# Altium project 0020-03_FFT2G.PrjPcb (part 3 of 5)

## Sheet [10] FPGA_ADC_S.SchDoc: FPGA ADC South
size 393 x 281 mm; SheetNumber: 10; SheetTotal: 21; PageSetup: Record=PageOptions|CenterHorizontal=True|CenterVertical=True|PrintScale=0.94|XCorrection=0.00|YCorrection=0.00|PrintKind=0|BorderSize=5000000|LeftOffset=0|BottomOffset=0|Orientation=2|PaperLength=1000|PaperWidth=1000|Scale=100|PaperSource=15|PrintQuality=600|MediaType=1|DitherType=10|PrintScaleMode=1|PaperKind=A4; Adr1: August Barks gata 6B; Adr2: SE-421 32 Västra Frölunda; Adr3: Sweden; Webpage: www.omnisys.se
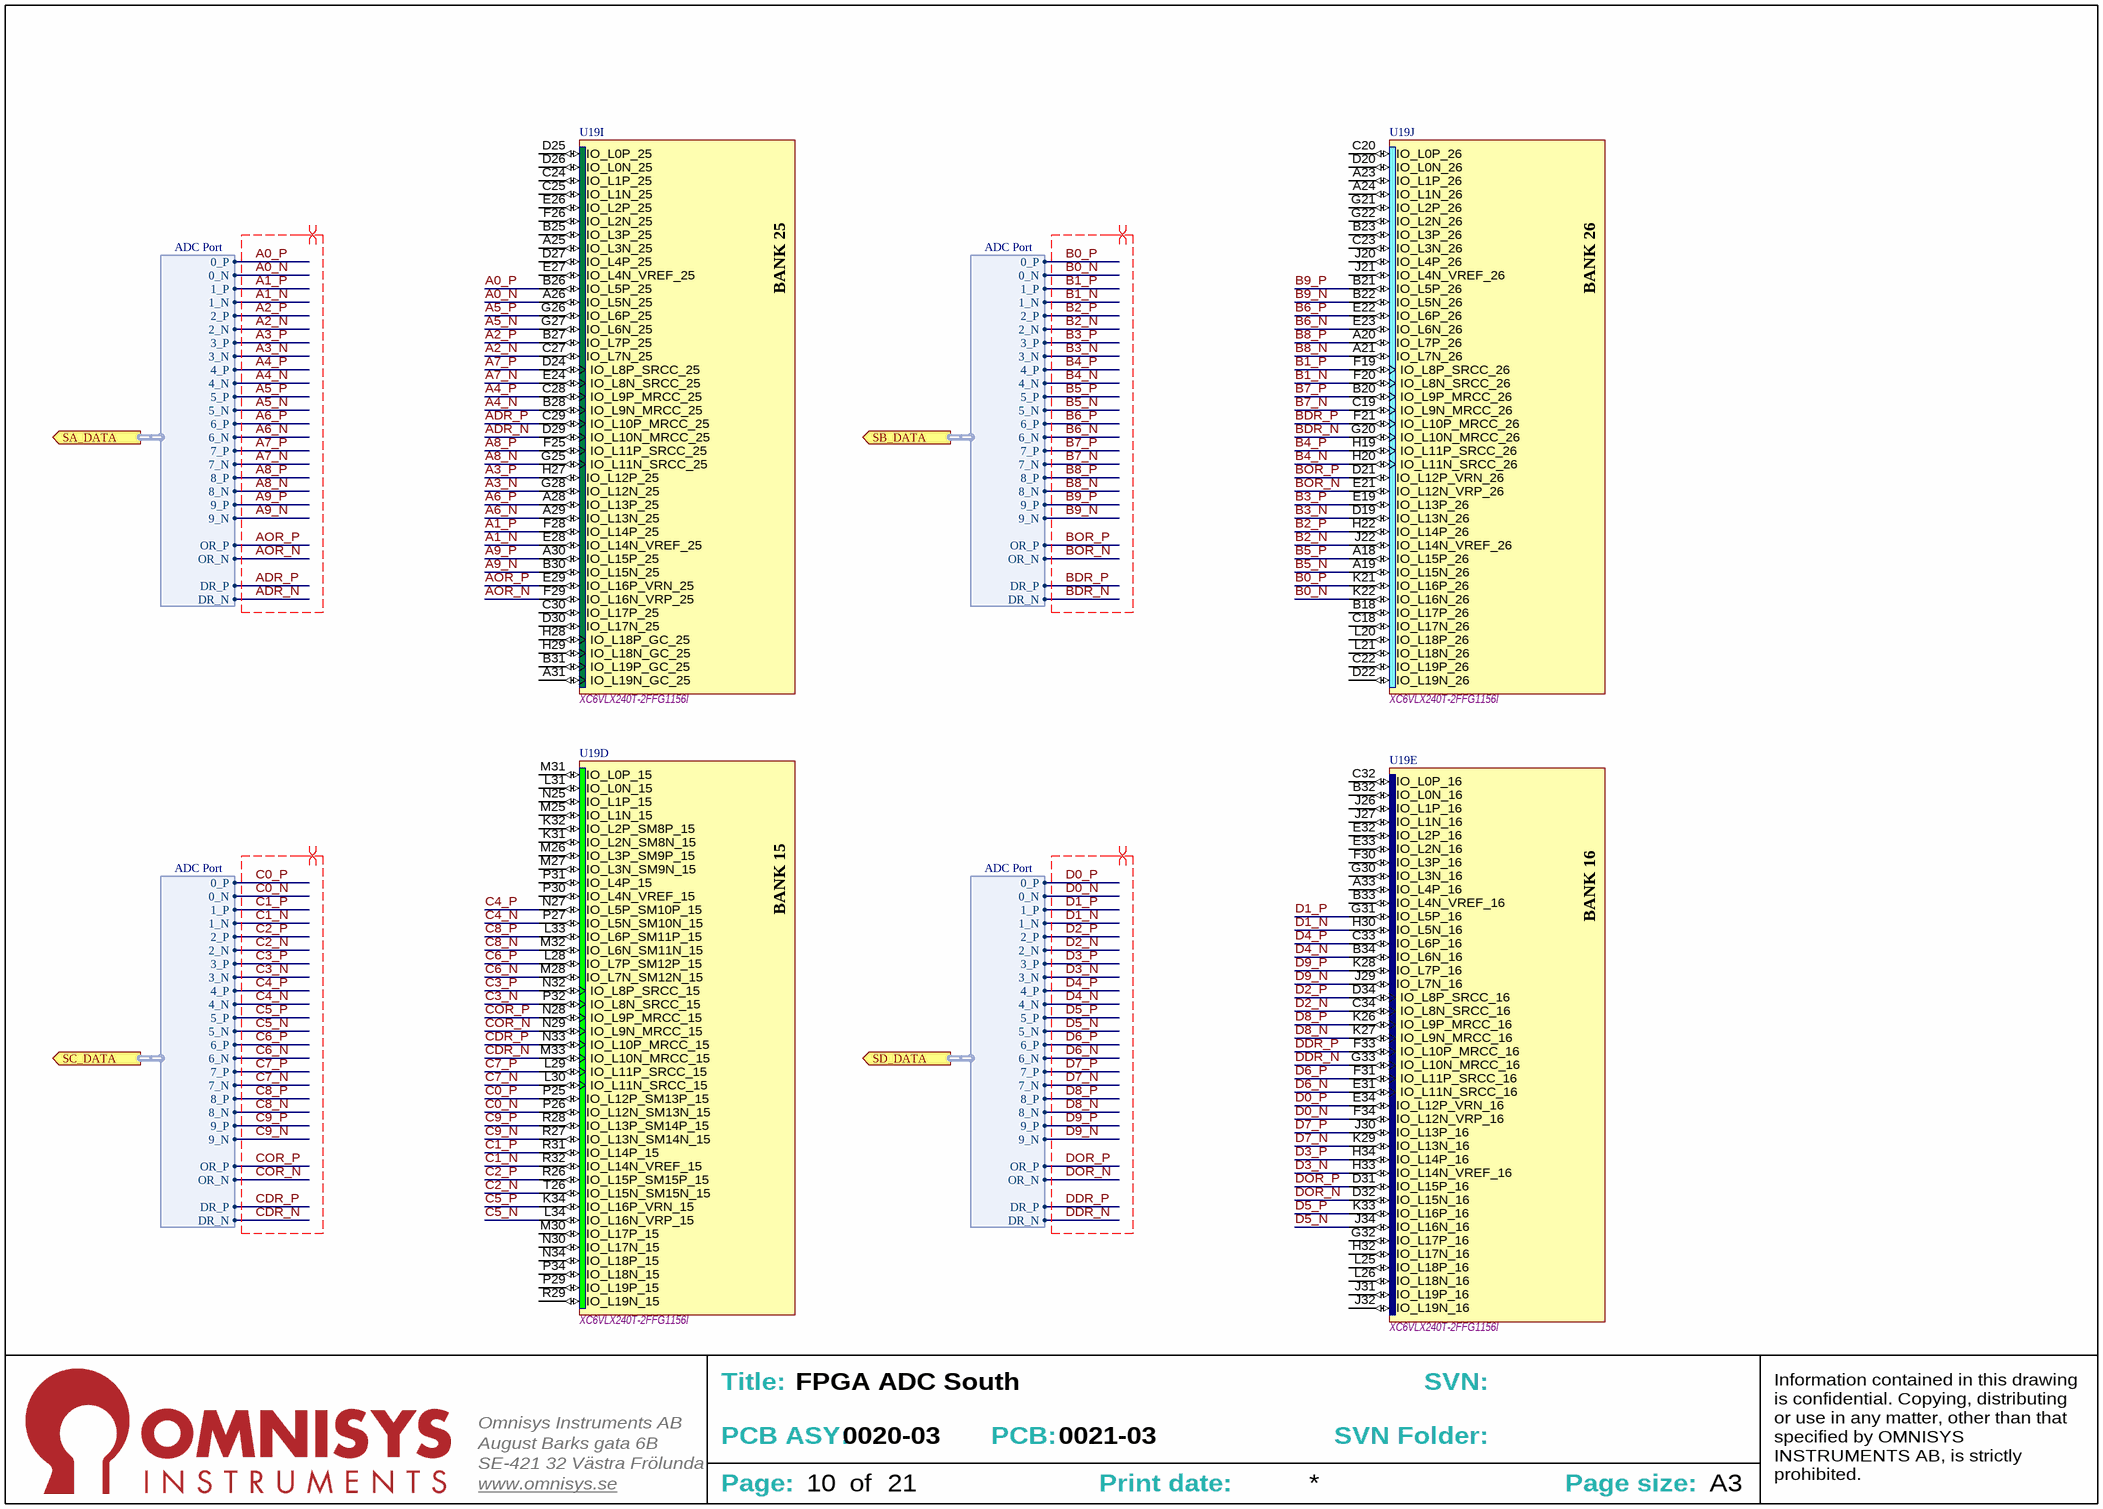
[diagram p5: [10] FPGA_ADC_S.SchDoc]

### Parts
U19  XC6VLX240T-2FFG1156I  [FFG1156]  (parts D,E,I,J of 20)

### Ports
SA_DATA (out, harness ADC Port), SB_DATA (out, harness ADC Port), SC_DATA (out, harness ADC Port), SD_DATA (out, harness ADC Port)

### Harnesses
ADC Port: 0_P, 1_P, 2_P, 3_P, 4_P, 5_P, 6_P, 7_P, 8_P, 9_P, 0_N, 1_N, 2_N, 3_N, 4_N, 5_N, 6_N, 7_N, 8_N, 9_N, OR_P, OR_N, DR_P, DR_N

### Nets
A0_N: U19.A26(IO_L5N_25) ; port SA_DATA.0_N  [project net SA.0_N]
A0_P: U19.B26(IO_L5P_25) ; port SA_DATA.0_P  [project net SA.0_P]
A1_N: U19.E28(IO_L14N_VREF_25) ; port SA_DATA.1_N  [project net SA.1_N]
A1_P: U19.F28(IO_L14P_25) ; port SA_DATA.1_P  [project net SA.1_P]
A2_N: U19.C27(IO_L7N_25) ; port SA_DATA.2_N  [project net SA.2_N]
A2_P: U19.B27(IO_L7P_25) ; port SA_DATA.2_P  [project net SA.2_P]
A3_N: U19.G28(IO_L12N_25) ; port SA_DATA.3_N  [project net SA.3_N]
A3_P: U19.H27(IO_L12P_25) ; port SA_DATA.3_P  [project net SA.3_P]
A4_N: U19.B28(IO_L9N_MRCC_25) ; port SA_DATA.4_N  [project net SA.4_N]
A4_P: U19.C28(IO_L9P_MRCC_25) ; port SA_DATA.4_P  [project net SA.4_P]
A5_N: U19.G27(IO_L6N_25) ; port SA_DATA.5_N  [project net SA.5_N]
A5_P: U19.G26(IO_L6P_25) ; port SA_DATA.5_P  [project net SA.5_P]
A6_N: U19.A29(IO_L13N_25) ; port SA_DATA.6_N  [project net SA.6_N]
A6_P: U19.A28(IO_L13P_25) ; port SA_DATA.6_P  [project net SA.6_P]
A7_N: U19.E24(IO_L8N_SRCC_25) ; port SA_DATA.7_N  [project net SA.7_N]
A7_P: U19.D24(IO_L8P_SRCC_25) ; port SA_DATA.7_P  [project net SA.7_P]
A8_N: U19.G25(IO_L11N_SRCC_25) ; port SA_DATA.8_N  [project net SA.8_N]
A8_P: U19.F25(IO_L11P_SRCC_25) ; port SA_DATA.8_P  [project net SA.8_P]
A9_N: U19.B30(IO_L15N_25) ; port SA_DATA.9_N  [project net SA.9_N]
A9_P: U19.A30(IO_L15P_25) ; port SA_DATA.9_P  [project net SA.9_P]
ADR_N: U19.D29(IO_L10N_MRCC_25) ; port SA_DATA.DR_N  [project net SA.DR_N]
ADR_P: U19.C29(IO_L10P_MRCC_25) ; port SA_DATA.DR_P  [project net SA.DR_P]
AOR_N: U19.F29(IO_L16N_VRP_25) ; port SA_DATA.OR_N  [project net SA.OR_N]
AOR_P: U19.E29(IO_L16P_VRN_25) ; port SA_DATA.OR_P  [project net SA.OR_P]
B0_N: U19.K22(IO_L16N_26) ; port SB_DATA.0_N  [project net SB.0_N]
B0_P: U19.K21(IO_L16P_26) ; port SB_DATA.0_P  [project net SB.0_P]
B1_N: U19.F20(IO_L8N_SRCC_26) ; port SB_DATA.1_N  [project net SB.1_N]
B1_P: U19.F19(IO_L8P_SRCC_26) ; port SB_DATA.1_P  [project net SB.1_P]
B2_N: U19.J22(IO_L14N_VREF_26) ; port SB_DATA.2_N  [project net SB.2_N]
B2_P: U19.H22(IO_L14P_26) ; port SB_DATA.2_P  [project net SB.2_P]
B3_N: U19.D19(IO_L13N_26) ; port SB_DATA.3_N  [project net SB.3_N]
B3_P: U19.E19(IO_L13P_26) ; port SB_DATA.3_P  [project net SB.3_P]
B4_N: U19.H20(IO_L11N_SRCC_26) ; port SB_DATA.4_N  [project net SB.4_N]
B4_P: U19.H19(IO_L11P_SRCC_26) ; port SB_DATA.4_P  [project net SB.4_P]
B5_N: U19.A19(IO_L15N_26) ; port SB_DATA.5_N  [project net SB.5_N]
B5_P: U19.A18(IO_L15P_26) ; port SB_DATA.5_P  [project net SB.5_P]
B6_N: U19.E23(IO_L6N_26) ; port SB_DATA.6_N  [project net SB.6_N]
B6_P: U19.E22(IO_L6P_26) ; port SB_DATA.6_P  [project net SB.6_P]
B7_N: U19.C19(IO_L9N_MRCC_26) ; port SB_DATA.7_N  [project net SB.7_N]
B7_P: U19.B20(IO_L9P_MRCC_26) ; port SB_DATA.7_P  [project net SB.7_P]
B8_N: U19.A21(IO_L7N_26) ; port SB_DATA.8_N  [project net SB.8_N]
B8_P: U19.A20(IO_L7P_26) ; port SB_DATA.8_P  [project net SB.8_P]
B9_N: U19.B22(IO_L5N_26) ; port SB_DATA.9_N  [project net SB.9_N]
B9_P: U19.B21(IO_L5P_26) ; port SB_DATA.9_P  [project net SB.9_P]
BDR_N: U19.G20(IO_L10N_MRCC_26) ; port SB_DATA.DR_N  [project net SB.DR_N]
BDR_P: U19.F21(IO_L10P_MRCC_26) ; port SB_DATA.DR_P  [project net SB.DR_P]
BOR_N: U19.E21(IO_L12N_VRP_26) ; port SB_DATA.OR_N  [project net SB.OR_N]
BOR_P: U19.D21(IO_L12P_VRN_26) ; port SB_DATA.OR_P  [project net SB.OR_P]
C0_N: U19.P26(IO_L12N_SM13N_15) ; port SC_DATA.0_N  [project net SC.0_N]
C0_P: U19.P25(IO_L12P_SM13P_15) ; port SC_DATA.0_P  [project net SC.0_P]
C1_N: U19.R32(IO_L14N_VREF_15) ; port SC_DATA.1_N  [project net SC.1_N]
C1_P: U19.R31(IO_L14P_15) ; port SC_DATA.1_P  [project net SC.1_P]
C2_N: U19.T26(IO_L15N_SM15N_15) ; port SC_DATA.2_N  [project net SC.2_N]
C2_P: U19.R26(IO_L15P_SM15P_15) ; port SC_DATA.2_P  [project net SC.2_P]
C3_N: U19.P32(IO_L8N_SRCC_15) ; port SC_DATA.3_N  [project net SC.3_N]
C3_P: U19.N32(IO_L8P_SRCC_15) ; port SC_DATA.3_P  [project net SC.3_P]
C4_N: U19.P27(IO_L5N_SM10N_15) ; port SC_DATA.4_N  [project net SC.4_N]
C4_P: U19.N27(IO_L5P_SM10P_15) ; port SC_DATA.4_P  [project net SC.4_P]
C5_N: U19.L34(IO_L16N_VRP_15) ; port SC_DATA.5_N  [project net SC.5_N]
C5_P: U19.K34(IO_L16P_VRN_15) ; port SC_DATA.5_P  [project net SC.5_P]
C6_N: U19.M28(IO_L7N_SM12N_15) ; port SC_DATA.6_N  [project net SC.6_N]
C6_P: U19.L28(IO_L7P_SM12P_15) ; port SC_DATA.6_P  [project net SC.6_P]
C7_N: U19.L30(IO_L11N_SRCC_15) ; port SC_DATA.7_N  [project net SC.7_N]
C7_P: U19.L29(IO_L11P_SRCC_15) ; port SC_DATA.7_P  [project net SC.7_P]
C8_N: U19.M32(IO_L6N_SM11N_15) ; port SC_DATA.8_N  [project net SC.8_N]
C8_P: U19.L33(IO_L6P_SM11P_15) ; port SC_DATA.8_P  [project net SC.8_P]
C9_N: U19.R27(IO_L13N_SM14N_15) ; port SC_DATA.9_N  [project net SC.9_N]
C9_P: U19.R28(IO_L13P_SM14P_15) ; port SC_DATA.9_P  [project net SC.9_P]
CDR_N: U19.M33(IO_L10N_MRCC_15) ; port SC_DATA.DR_N  [project net SC.DR_N]
CDR_P: U19.N33(IO_L10P_MRCC_15) ; port SC_DATA.DR_P  [project net SC.DR_P]
COR_N: U19.N29(IO_L9N_MRCC_15) ; port SC_DATA.OR_N  [project net SC.OR_N]
COR_P: U19.N28(IO_L9P_MRCC_15) ; port SC_DATA.OR_P  [project net SC.OR_P]
D0_N: U19.F34(IO_L12N_VRP_16) ; port SD_DATA.0_N  [project net SD.0_N]
D0_P: U19.E34(IO_L12P_VRN_16) ; port SD_DATA.0_P  [project net SD.0_P]
D1_N: U19.H30(IO_L5N_16) ; port SD_DATA.1_N  [project net SD.1_N]
D1_P: U19.G31(IO_L5P_16) ; port SD_DATA.1_P  [project net SD.1_P]
D2_N: U19.C34(IO_L8N_SRCC_16) ; port SD_DATA.2_N  [project net SD.2_N]
D2_P: U19.D34(IO_L8P_SRCC_16) ; port SD_DATA.2_P  [project net SD.2_P]
D3_N: U19.H33(IO_L14N_VREF_16) ; port SD_DATA.3_N  [project net SD.3_N]
D3_P: U19.H34(IO_L14P_16) ; port SD_DATA.3_P  [project net SD.3_P]
D4_N: U19.B34(IO_L6N_16) ; port SD_DATA.4_N  [project net SD.4_N]
D4_P: U19.C33(IO_L6P_16) ; port SD_DATA.4_P  [project net SD.4_P]
D5_N: U19.J34(IO_L16N_16) ; port SD_DATA.5_N  [project net SD.5_N]
D5_P: U19.K33(IO_L16P_16) ; port SD_DATA.5_P  [project net SD.5_P]
D6_N: U19.E31(IO_L11N_SRCC_16) ; port SD_DATA.6_N  [project net SD.6_N]
D6_P: U19.F31(IO_L11P_SRCC_16) ; port SD_DATA.6_P  [project net SD.6_P]
D7_N: U19.K29(IO_L13N_16) ; port SD_DATA.7_N  [project net SD.7_N]
D7_P: U19.J30(IO_L13P_16) ; port SD_DATA.7_P  [project net SD.7_P]
D8_N: U19.K27(IO_L9N_MRCC_16) ; port SD_DATA.8_N  [project net SD.8_N]
D8_P: U19.K26(IO_L9P_MRCC_16) ; port SD_DATA.8_P  [project net SD.8_P]
D9_N: U19.J29(IO_L7N_16) ; port SD_DATA.9_N  [project net SD.9_N]
D9_P: U19.K28(IO_L7P_16) ; port SD_DATA.9_P  [project net SD.9_P]
DDR_N: U19.G33(IO_L10N_MRCC_16) ; port SD_DATA.DR_N  [project net SD.DR_N]
DDR_P: U19.F33(IO_L10P_MRCC_16) ; port SD_DATA.DR_P  [project net SD.DR_P]
DOR_N: U19.D32(IO_L15N_16) ; port SD_DATA.OR_N  [project net SD.OR_N]
DOR_P: U19.D31(IO_L15P_16) ; port SD_DATA.OR_P  [project net SD.OR_P]

Not connected (* = marked no-connect by the designer): U19 A23(IO_L1P_26) A24(IO_L1N_26) A25(IO_L3N_25) A31(IO_L19N_GC_25) A33(IO_L4P_16) B18(IO_L17P_26) B23(IO_L3P_26) B25(IO_L3P_25) B31(IO_L19P_GC_25) B32(IO_L0N_16) B33(IO_L4N_VREF_16) C18(IO_L17N_26) C20(IO_L0P_26) C22(IO_L19P_26) C23(IO_L3N_26) C24(IO_L1P_25) C25(IO_L1N_25) C30(IO_L17P_25) C32(IO_L0P_16) D20(IO_L0N_26) D22(IO_L19N_26) D25(IO_L0P_25) D26(IO_L0N_25) D27(IO_L4P_25) D30(IO_L17N_25) E26(IO_L2P_25) E27(IO_L4N_VREF_25) E32(IO_L2P_16) E33(IO_L2N_16) F26(IO_L2N_25) F30(IO_L3P_16) G21(IO_L2P_26) G22(IO_L2N_26) G30(IO_L3N_16) G32(IO_L17P_16) H28(IO_L18P_GC_25) H29(IO_L18N_GC_25) H32(IO_L17N_16) J20(IO_L4P_26) J21(IO_L4N_VREF_26) J26(IO_L1P_16) J27(IO_L1N_16) J31(IO_L19P_16) J32(IO_L19N_16) K31(IO_L2N_SM8N_15) K32(IO_L2P_SM8P_15) L20(IO_L18P_26) L21(IO_L18N_26) L25(IO_L18P_16) L26(IO_L18N_16) L31(IO_L0N_15) M25(IO_L1N_15) M26(IO_L3P_SM9P_15) M27(IO_L3N_SM9N_15) M30(IO_L17P_15) M31(IO_L0P_15) N25(IO_L1P_15) N30(IO_L17N_15) N34(IO_L18P_15) P29(IO_L19P_15) P30(IO_L4N_VREF_15) P31(IO_L4P_15) P34(IO_L18N_15) R29(IO_L19N_15)

### Layout directives
differential pair; rule Differential Pairs Routing [Pref Gap = 0.1mm    Min Gap  = 0.1mm    Max Gap  = 0.1mmPref Width = 0.1mm    Min Width  = 0.1mm    Max Width  = 0.1mm]; net class DiffPairs_FPGA: A0_N, A0_P, A1_N, A1_P, A2_N, A2_P, A3_N, A3_P, A4_N, A4_P, A5_N, A5_P, A6_N, A6_P, A7_N, A7_P, A8_N, A8_P, A9_N, A9_P, ADR_N, ADR_P, AOR_N, AOR_P, B0_N, B0_P, B1_N, B1_P, B2_N, B2_P, B3_N, B3_P, B4_N, B4_P, B5_N, B5_P, B6_N, B6_P, B7_N, B7_P, B8_N, B8_P, B9_N, B9_P, BDR_N, BDR_P, BOR_N, BOR_P, C0_N, C0_P, C1_N, C1_P, C2_N, C2_P, C3_N, C3_P, C4_N, C4_P, C5_N, C5_P, C6_N, C6_P, C7_N, C7_P, C8_N, C8_P, C9_N, C9_P, CDR_N, CDR_P, COR_N, COR_P, D0_N, D0_P, D1_N, D1_P, D2_N, D2_P, D3_N, D3_P, D4_N, D4_P, D5_N, D5_P, D6_N, D6_P, D7_N, D7_P, D8_N, D8_P, D9_N, D9_P, DDR_N, DDR_P, DOR_N, DOR_P

### Notes on the sheet
- Title:
- SVN:
- August Barks gata 6B
- SE-421 32 Västra Frölunda
- Omnisys Instruments AB
- PCB ASY:
- PCB:
- SVN Folder:
- www.omnisys.se
- Page:
- of
- Print date:
- Page size:
- A3
- Information contained in this drawing is confidential. Copying, distributing or use in any matter, other than that specified by OMNISYS INSTRUMENTS AB, is strictly prohibited.
- (in symbol CMP-2100-000586-1, part D) BANK 15
- (in symbol CMP-2100-000586-1, part E) BANK 16
- (in symbol CMP-2100-000586-1, part I) BANK 25
- (in symbol CMP-2100-000586-1, part J) BANK 26

### Library data of the parts
U19 = CMP-2100-000586-1: FPGA Virtex-6 LXT Family 241152 Cells 40nm (CMOS) Technology 1V 1156-Pin FCBGA; Number of I/Os: 600; Number of Logic Blocks (LABs): 18840; Number of Logic Elements/Cells: 241152; RAM Size: 15335424b; Speed Grade: 2; Case/Package: FCBGA; Max Operating Temperature: 100°C; Min Operating Temperature: -40°C; Mount: Surface Mount; Number of Pins: 1156; Operating Supply Voltage: 1V; Package Quantity: 1

## Sheet [12] FPGA_MONITOR.SchDoc: FPGA Monitor
size 393 x 281 mm; SheetNumber: 12; SheetTotal: 21; PageSetup: Record=PageOptions|CenterHorizontal=True|CenterVertical=True|PrintScale=0.94|XCorrection=0.00|YCorrection=0.00|PrintKind=0|BorderSize=5000000|LeftOffset=0|BottomOffset=0|Orientation=2|PaperLength=1000|PaperWidth=1000|Scale=100|PaperSource=15|PrintQuality=600|MediaType=1|DitherType=10|PrintScaleMode=1|PaperKind=A4; Adr1: August Barks gata 6B; Adr2: SE-421 32 Västra Frölunda; Adr3: Sweden; Webpage: www.omnisys.se
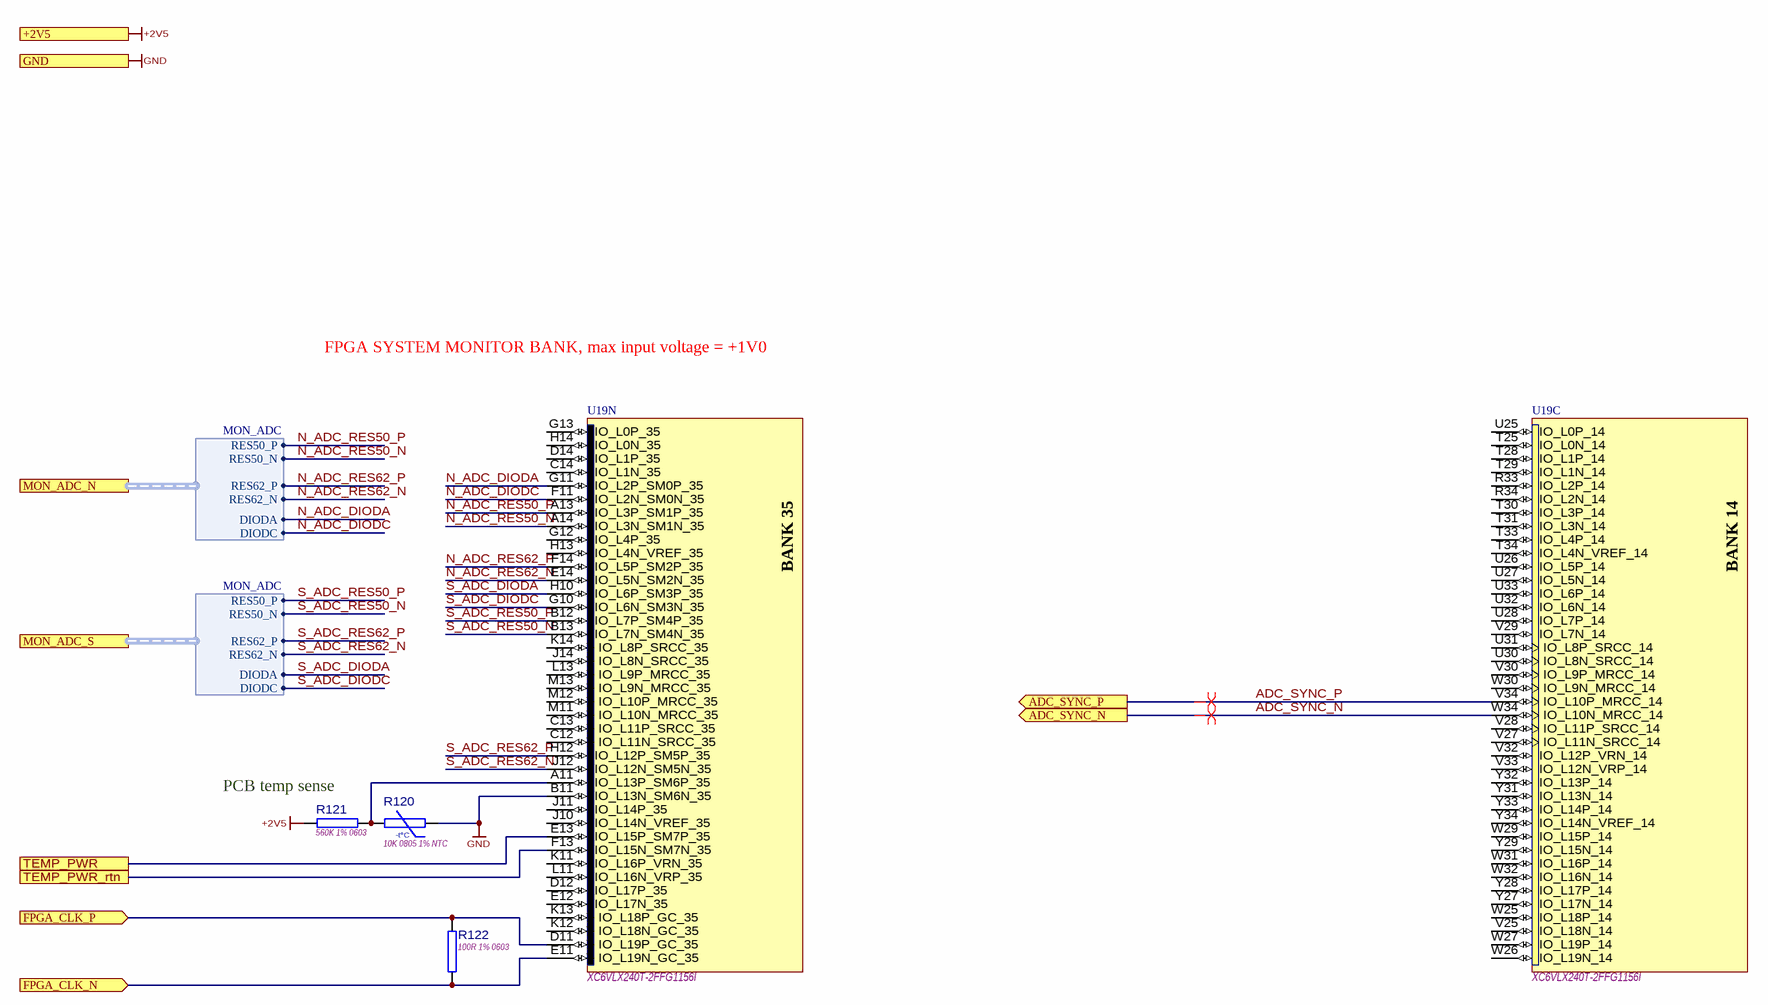
[diagram p6: [12] FPGA_MONITOR.SchDoc]

### Parts
R120  10K 0805 1% NTC  [RESC2012N]
R121  560K 1% 0603  [RESC1608N]
R122  100R 1% 0603  [RESC1608N]
U19  XC6VLX240T-2FFG1156I  [FFG1156]  (parts C,N of 20)

### Ports
+2V5, ADC_SYNC_N (out), ADC_SYNC_P (out), FPGA_CLK_N (in), FPGA_CLK_P (in), GND, MON_ADC_N (harness MON_ADC), MON_ADC_S (harness MON_ADC), TEMP_PWR, TEMP_PWR_rtn

### Harnesses
MON_ADC: DIODA, DIODC, RES50_P, RES50_N, RES62_P, RES62_N

### Nets
+2V5: R121.1 ; port +2V5
GND: R120.1 U19.B11(IO_L13N_SM6N_35) ; port GND
ADC_SYNC_N: U19.W34(IO_L10N_MRCC_14) ; port ADC_SYNC_N
ADC_SYNC_P: U19.V34(IO_L10P_MRCC_14) ; port ADC_SYNC_P
FPGA_CLK_N: R122.1 U19.E11(IO_L19N_GC_35) ; port FPGA_CLK_N
FPGA_CLK_P: R122.2 U19.D11(IO_L19P_GC_35) ; port FPGA_CLK_P
N_ADC_DIODA: U19.G11(IO_L2P_SM0P_35) ; port MON_ADC_N.DIODA  [project net MON_ADC_N.DIODA]
N_ADC_DIODC: U19.F11(IO_L2N_SM0N_35) ; port MON_ADC_N.DIODC  [project net MON_ADC_N.DIODC]
N_ADC_RES50_N: U19.A14(IO_L3N_SM1N_35) ; port MON_ADC_N.RES50_N  [project net MON_ADC_N.RES50_N]
N_ADC_RES50_P: U19.A13(IO_L3P_SM1P_35) ; port MON_ADC_N.RES50_P  [project net MON_ADC_N.RES50_P]
N_ADC_RES62_N: U19.E14(IO_L5N_SM2N_35) ; port MON_ADC_N.RES62_N  [project net MON_ADC_N.RES62_N]
N_ADC_RES62_P: U19.F14(IO_L5P_SM2P_35) ; port MON_ADC_N.RES62_P  [project net MON_ADC_N.RES62_P]
S_ADC_DIODA: U19.H10(IO_L6P_SM3P_35) ; port MON_ADC_S.DIODA  [project net MON_ADC_S.DIODA]
S_ADC_DIODC: U19.G10(IO_L6N_SM3N_35) ; port MON_ADC_S.DIODC  [project net MON_ADC_S.DIODC]
S_ADC_RES50_N: U19.B13(IO_L7N_SM4N_35) ; port MON_ADC_S.RES50_N  [project net MON_ADC_S.RES50_N]
S_ADC_RES50_P: U19.B12(IO_L7P_SM4P_35) ; port MON_ADC_S.RES50_P  [project net MON_ADC_S.RES50_P]
S_ADC_RES62_N: U19.J12(IO_L12N_SM5N_35) ; port MON_ADC_S.RES62_N  [project net MON_ADC_S.RES62_N]
S_ADC_RES62_P: U19.H12(IO_L12P_SM5P_35) ; port MON_ADC_S.RES62_P  [project net MON_ADC_S.RES62_P]
TEMP_PWR: U19.E13(IO_L15P_SM7P_35) ; port TEMP_PWR
TEMP_PWR_rtn: U19.F13(IO_L15N_SM7N_35) ; port TEMP_PWR_rtn
NetR120_2: R120.2 R121.2 U19.A11(IO_L13P_SM6P_35)

Not connected (* = marked no-connect by the designer): U19 C12(IO_L11N_SRCC_35) C13(IO_L11P_SRCC_35) C14(IO_L1N_35) D12(IO_L17P_35) D14(IO_L1P_35) E12(IO_L17N_35) G12(IO_L4P_35) G13(IO_L0P_35) H13(IO_L4N_VREF_35) H14(IO_L0N_35) J10(IO_L14N_VREF_35) J11(IO_L14P_35) J14(IO_L8N_SRCC_35) K11(IO_L16P_VRN_35) K12(IO_L18N_GC_35) K13(IO_L18P_GC_35) K14(IO_L8P_SRCC_35) L11(IO_L16N_VRP_35) L13(IO_L9P_MRCC_35) M11(IO_L10N_MRCC_35) M12(IO_L10P_MRCC_35) M13(IO_L9N_MRCC_35) R33(IO_L2P_14) R34(IO_L2N_14) T25(IO_L0N_14) T28(IO_L1P_14) T29(IO_L1N_14) T30(IO_L3P_14) T31(IO_L3N_14) T33(IO_L4P_14) T34(IO_L4N_VREF_14) U25(IO_L0P_14) U26(IO_L5P_14) U27(IO_L5N_14) U28(IO_L7P_14) U30(IO_L8N_SRCC_14) U31(IO_L8P_SRCC_14) U32(IO_L6N_14) U33(IO_L6P_14) V25(IO_L18N_14) V27(IO_L11N_SRCC_14) V28(IO_L11P_SRCC_14) V29(IO_L7N_14) V30(IO_L9P_MRCC_14) V32(IO_L12P_VRN_14) V33(IO_L12N_VRP_14) W25(IO_L18P_14) W26(IO_L19N_14) W27(IO_L19P_14) W29(IO_L15P_14) W30(IO_L9N_MRCC_14) W31(IO_L16P_14) W32(IO_L16N_14) Y27(IO_L17N_14) Y28(IO_L17P_14) Y29(IO_L15N_14) Y31(IO_L13N_14) Y32(IO_L13P_14) Y33(IO_L14P_14) Y34(IO_L14N_VREF_14)

### Layout directives
differential pair: ADC_SYNC_N, ADC_SYNC_P

### Notes on the sheet
- FPGA SYSTEM MONITOR BANK, max input voltage = +1V0
- (near R121) PCB temp sense
- Title:
- SVN:
- August Barks gata 6B
- SE-421 32 Västra Frölunda
- Omnisys Instruments AB
- PCB ASY:
- PCB:
- SVN Folder:
- www.omnisys.se
- Page:
- of
- Print date:
- Page size:
- A3
- Information contained in this drawing is confidential. Copying, distributing or use in any matter, other than that specified by OMNISYS INSTRUMENTS AB, is strictly prohibited.
- (in symbol CMP-1800-003166-2) -t°C
- (in symbol CMP-2100-000586-1, part C) BANK 14
- (in symbol CMP-2100-000586-1, part N) BANK 35

### Library data of the parts
R120 = CMP-1800-003166-2: 10K NTC resistor 1%  0805 (2012 metric); PartNumber: NTCS0805E3103FLT; Case-EIA: 0805; Case-Metric: 2012
R121 = CMP-1800-002087-5: Thick film Chip Resistor, 0603/1608; Power: 100mW; Maximum working voltage: 75V; Temp. Coefficent: 0.01%; Value: 560k; Tolerance: 1%; Case/Package: 0603/1608; Composition: Thick film
R122 = CMP-1800-001998-5: Thick film Chip Resistor, 0603/1608; Value: 100; Power: 100mW; Maximum working voltage: 75V; Temp. Coefficent: 0.01%; Tolerance: 1%; Case/Package: 0603/1608; Composition: Thick film
U19 = CMP-2100-000586-1: as U19 on sheet [10] FPGA_ADC_S; Case/Package: FCBGA; Max Operating Temperature: 100°C; Min Operating Temperature: -40°C; Mount: Surface Mount; Number of Pins: 1156; Operating Supply Voltage: 1V; Package Quantity: 1

## Sheet [15] FPGA_UNUSED.SchDoc: FPGA Unused
size 393 x 281 mm; SheetNumber: 15; SheetTotal: 21; PageSetup: Record=PageOptions|CenterHorizontal=True|CenterVertical=True|PrintScale=0.94|XCorrection=0.00|YCorrection=0.00|PrintKind=0|BorderSize=5000000|LeftOffset=0|BottomOffset=0|Orientation=2|PaperLength=1000|PaperWidth=1000|Scale=100|PaperSource=15|PrintQuality=600|MediaType=1|DitherType=10|PrintScaleMode=1|PaperKind=A4; Adr1: August Barks gata 6B; Adr2: SE-421 32 Västra Frölunda; Adr3: Sweden; Webpage: www.omnisys.se
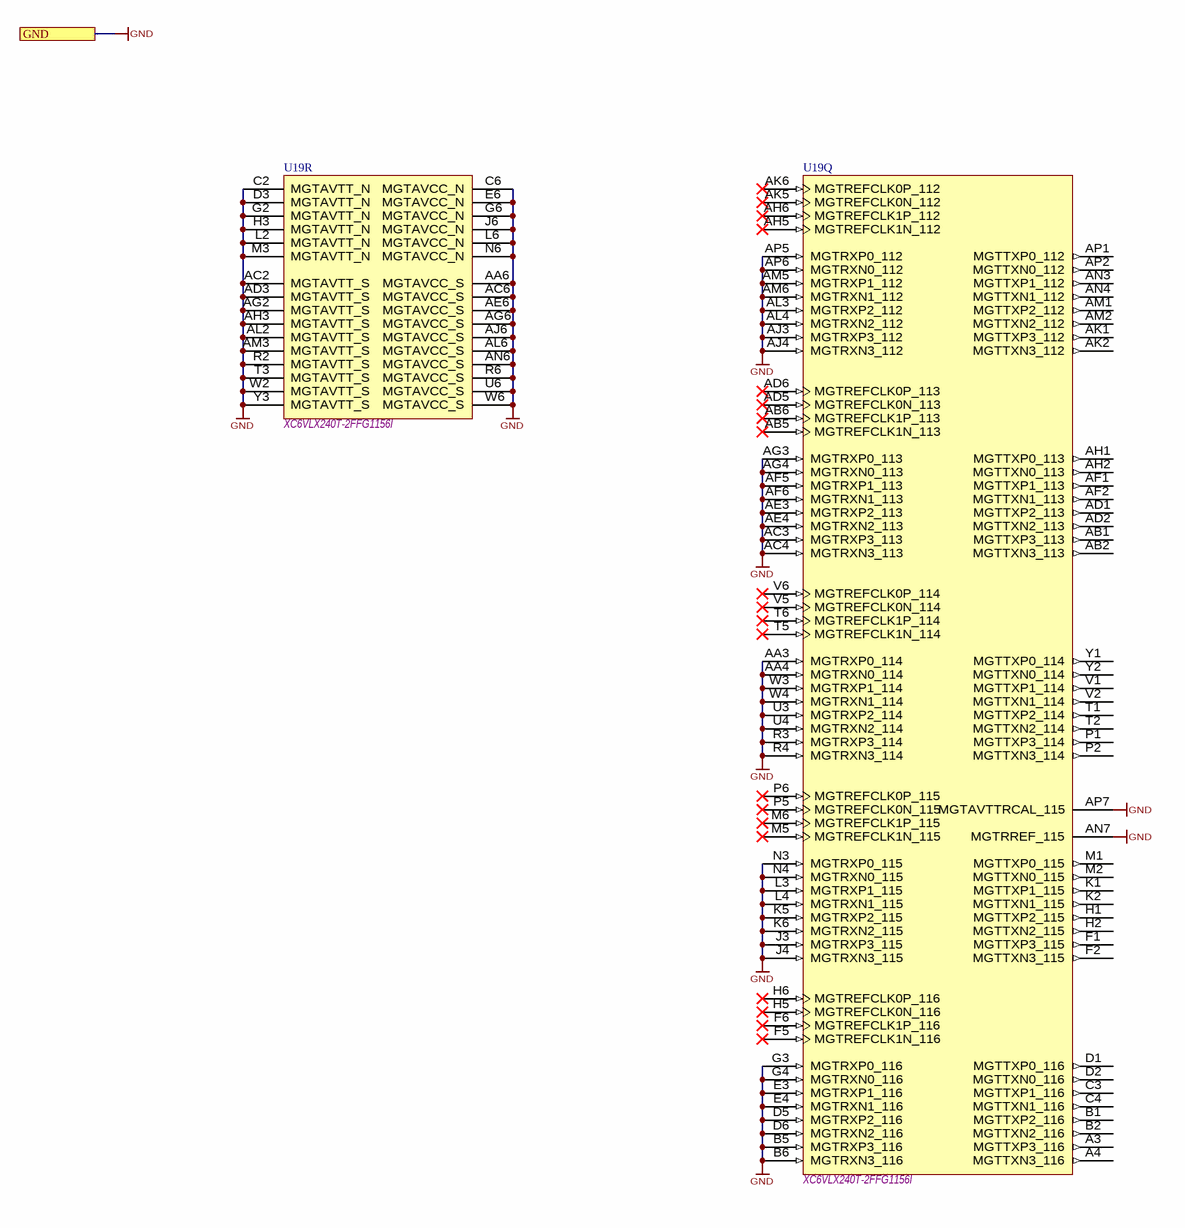
[diagram p7: [15] FPGA_UNUSED.SchDoc]

### Parts
U19  XC6VLX240T-2FFG1156I  [FFG1156]  (parts Q,R of 20)

### Ports
GND

### Nets
GND: U19.AA3(MGTRXP0_114) U19.AA4(MGTRXN0_114) U19.AA6(MGTAVCC_S) U19.AC2(MGTAVTT_S) U19.AC3(MGTRXP3_113) U19.AC4(MGTRXN3_113) U19.AC6(MGTAVCC_S) U19.AD3(MGTAVTT_S) U19.AE3(MGTRXP2_113) U19.AE4(MGTRXN2_113) U19.AE6(MGTAVCC_S) U19.AF5(MGTRXP1_113) U19.AF6(MGTRXN1_113) U19.AG2(MGTAVTT_S) U19.AG3(MGTRXP0_113) U19.AG4(MGTRXN0_113) U19.AG6(MGTAVCC_S) U19.AH3(MGTAVTT_S) U19.AJ3(MGTRXP3_112) U19.AJ4(MGTRXN3_112) U19.AJ6(MGTAVCC_S) U19.AL2(MGTAVTT_S) U19.AL3(MGTRXP2_112) U19.AL4(MGTRXN2_112) U19.AL6(MGTAVCC_S) U19.AM3(MGTAVTT_S) U19.AM5(MGTRXP1_112) U19.AM6(MGTRXN1_112) U19.AN6(MGTAVCC_S) U19.AN7(MGTRREF_115) U19.AP5(MGTRXP0_112) U19.AP6(MGTRXN0_112) U19.AP7(MGTAVTTRCAL_115) U19.B5(MGTRXP3_116) U19.B6(MGTRXN3_116) U19.C2(MGTAVTT_N) U19.C6(MGTAVCC_N) U19.D3(MGTAVTT_N) U19.D5(MGTRXP2_116) U19.D6(MGTRXN2_116) U19.E3(MGTRXP1_116) U19.E4(MGTRXN1_116) U19.E6(MGTAVCC_N) U19.G2(MGTAVTT_N) U19.G3(MGTRXP0_116) U19.G4(MGTRXN0_116) U19.G6(MGTAVCC_N) U19.H3(MGTAVTT_N) U19.J3(MGTRXP3_115) U19.J4(MGTRXN3_115) U19.J6(MGTAVCC_N) U19.K5(MGTRXP2_115) U19.K6(MGTRXN2_115) U19.L2(MGTAVTT_N) U19.L3(MGTRXP1_115) U19.L4(MGTRXN1_115) U19.L6(MGTAVCC_N) U19.M3(MGTAVTT_N) U19.N3(MGTRXP0_115) U19.N4(MGTRXN0_115) U19.N6(MGTAVCC_N) U19.R2(MGTAVTT_S) U19.R3(MGTRXP3_114) U19.R4(MGTRXN3_114) U19.R6(MGTAVCC_S) U19.T3(MGTAVTT_S) U19.U3(MGTRXP2_114) U19.U4(MGTRXN2_114) U19.U6(MGTAVCC_S) U19.W2(MGTAVTT_S) U19.W3(MGTRXP1_114) U19.W4(MGTRXN1_114) U19.W6(MGTAVCC_S) U19.Y3(MGTAVTT_S) ; port GND

Not connected (* = marked no-connect by the designer): U19 A3(MGTTXP3_116) A4(MGTTXN3_116) AB1(MGTTXP3_113) AB2(MGTTXN3_113) AB5(MGTREFCLK1N_113)* AB6(MGTREFCLK1P_113)* AD1(MGTTXP2_113) AD2(MGTTXN2_113) AD5(MGTREFCLK0N_113)* AD6(MGTREFCLK0P_113)* AF1(MGTTXP1_113) AF2(MGTTXN1_113) AH1(MGTTXP0_113) AH2(MGTTXN0_113) AH5(MGTREFCLK1N_112)* AH6(MGTREFCLK1P_112)* AK1(MGTTXP3_112) AK2(MGTTXN3_112) AK5(MGTREFCLK0N_112)* AK6(MGTREFCLK0P_112)* AM1(MGTTXP2_112) AM2(MGTTXN2_112) AN3(MGTTXP1_112) AN4(MGTTXN1_112) AP1(MGTTXP0_112) AP2(MGTTXN0_112) B1(MGTTXP2_116) B2(MGTTXN2_116) C3(MGTTXP1_116) C4(MGTTXN1_116) D1(MGTTXP0_116) D2(MGTTXN0_116) F1(MGTTXP3_115) F2(MGTTXN3_115) F5(MGTREFCLK1N_116)* F6(MGTREFCLK1P_116)* H1(MGTTXP2_115) H2(MGTTXN2_115) H5(MGTREFCLK0N_116)* H6(MGTREFCLK0P_116)* K1(MGTTXP1_115) K2(MGTTXN1_115) M1(MGTTXP0_115) M2(MGTTXN0_115) M5(MGTREFCLK1N_115)* M6(MGTREFCLK1P_115)* P1(MGTTXP3_114) P2(MGTTXN3_114) P5(MGTREFCLK0N_115)* P6(MGTREFCLK0P_115)* T1(MGTTXP2_114) T2(MGTTXN2_114) T5(MGTREFCLK1N_114)* T6(MGTREFCLK1P_114)* V1(MGTTXP1_114) V2(MGTTXN1_114) V5(MGTREFCLK0N_114)* V6(MGTREFCLK0P_114)* Y1(MGTTXP0_114) Y2(MGTTXN0_114)

### Notes on the sheet
- Title:
- SVN:
- August Barks gata 6B
- SE-421 32 Västra Frölunda
- Omnisys Instruments AB
- PCB ASY:
- PCB:
- SVN Folder:
- www.omnisys.se
- Page:
- of
- Print date:
- Page size:
- A3
- Information contained in this drawing is confidential. Copying, distributing or use in any matter, other than that specified by OMNISYS INSTRUMENTS AB, is strictly prohibited.

### Library data of the parts
U19 = CMP-2100-000586-1: as U19 on sheet [10] FPGA_ADC_S; Case/Package: FCBGA; Max Operating Temperature: 100°C; Min Operating Temperature: -40°C; Mount: Surface Mount; Number of Pins: 1156; Operating Supply Voltage: 1V; Package Quantity: 1

## Sheet [11] FPGA_CONFIG.SchDoc: FPGA Config
size 393 x 281 mm; SheetNumber: 11; SheetTotal: 21; PageSetup: Record=PageOptions|CenterHorizontal=True|CenterVertical=True|PrintScale=0.94|XCorrection=0.00|YCorrection=0.00|PrintKind=0|BorderSize=5000000|LeftOffset=0|BottomOffset=0|Orientation=2|PaperLength=1000|PaperWidth=1000|Scale=100|PaperSource=15|PrintQuality=600|MediaType=1|DitherType=10|PrintScaleMode=1|PaperKind=A4; Adr1: August Barks gata 6B; Adr2: SE-421 32 Västra Frölunda; Adr3: Sweden; Webpage: www.omnisys.se
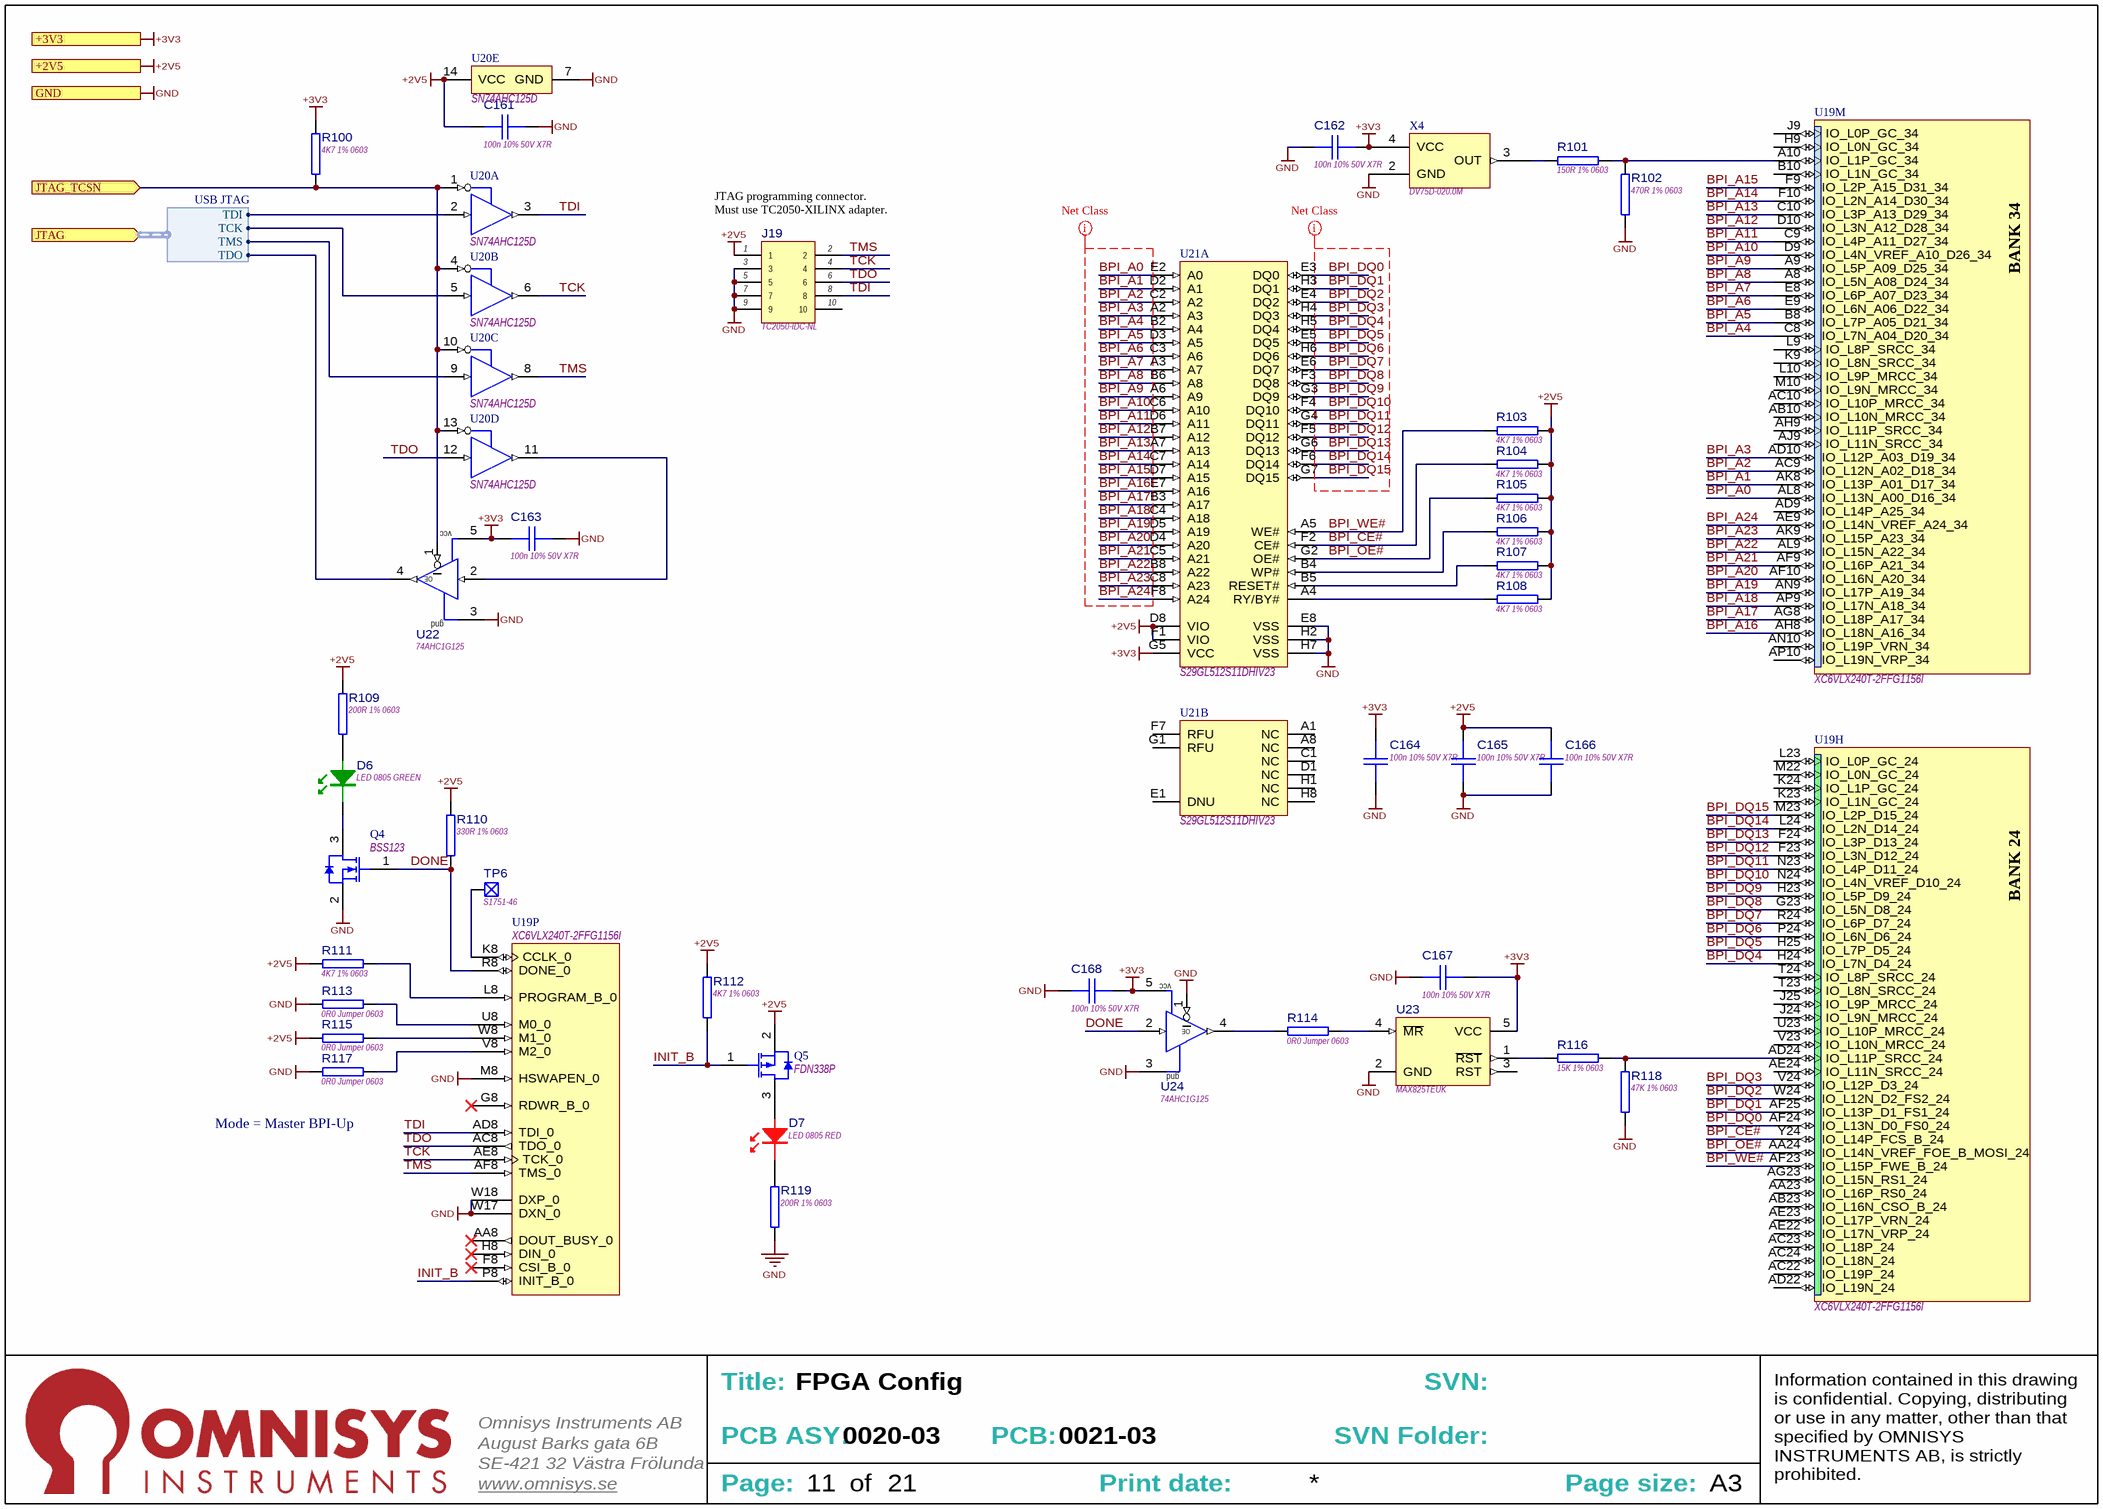
[diagram p8: [11] FPGA_CONFIG.SchDoc]

### Parts
C161  100n 10% 50V X7R  [CAPC1608X90N]
C162  100n 10% 50V X7R  [CAPC1608X90N]
C163  100n 10% 50V X7R  [CAPC1608X90N]
C164  100n 10% 50V X7R  [CAPC1608X90N]
C165  100n 10% 50V X7R  [CAPC1608X90N]
C166  100n 10% 50V X7R  [CAPC1608X90N]
C167  100n 10% 50V X7R  [CAPC1608X90N]
C168  100n 10% 50V X7R  [CAPC1608X90N]
D6  LED 0805 GREEN  [LED2012-GREEN]
D7  LED 0805 RED  [LED2012-RED]
J19  TC2050-IDC-NL  [TC2050-IDC without connector]
Q4  BSS123  [SOT95P230X110-3N]
Q5  FDN338P  [SOT95P230X110-3N]
R100  4K7 1% 0603  [RESC1608N]
R101  150R 1% 0603  [RESC1608N]
R102  470R 1% 0603  [RESC1608N]
R103  4K7 1% 0603  [RESC1608N]
R104  4K7 1% 0603  [RESC1608N]
R105  4K7 1% 0603  [RESC1608N]
R106  4K7 1% 0603  [RESC1608N]
R107  4K7 1% 0603  [RESC1608N]
R108  4K7 1% 0603  [RESC1608N]
R109  200R 1% 0603  [RESC1608N]
R110  330R 1% 0603  [RESC1608N]
R111  4K7 1% 0603  [RESC1608N]
R112  4K7 1% 0603  [RESC1608N]
R113  0R0 Jumper 0603  [RESC1608N]
R114  0R0 Jumper 0603  [RESC1608N]
R115  0R0 Jumper 0603  [RESC1608N]
R116  15K 1% 0603  [RESC1608N]
R117  0R0 Jumper 0603  [RESC1608N]
R118  47K 1% 0603  [RESC1608N]
R119  200R 1% 0603  [RESC1608N]
TP6  S1751-46  [S1751-46]
U19  XC6VLX240T-2FFG1156I  [FFG1156]  (parts H,M,P of 20)
U20  SN74AHC125D  [SOIC127P600X175-14N]  (parts A,B,C,D,E of 5)
U21  S29GL512S11DHIV23  [BGA64C100P8X8_900X900X140]  (parts A,B of 2)
U22  74AHC1G125  [SOT95P280X100-5N]
U23  MAX825TEUK  [SOT95P280X100-5N]
U24  74AHC1G125  [SOT95P280X100-5N]
X4  DV75D-020.0M  [DV75D]

### Ports
+2V5, +3V3, GND, JTAG (in, harness USB JTAG), JTAG_TCSN (in)

### Harnesses
USB JTAG: TCK, TDI, TDO, TMS

### Nets
+2V5: C161.1 C165.1 C166.1 J19.1 Q5.2(SOURCE) R103.1 R104.1 R105.1 R106.1 R107.1 R108.1 R109.2 R110.1 R111.2 R112.1 R115.1 U20.14(VCC) U21.D8(VIO) U21.F1(VIO) ; port +2V5
+3V3: C162.1 C163.1 C164.1 C167.2 C168.1 R100.2 U21.G5(VCC) U22.5(VCC) U23.5(VCC) U24.5(VCC) X4.4(VCC) ; port +3V3
GND: C161.2 C162.2 C163.2 C164.2 C165.2 C166.2 C167.1 C168.2 J19.3 J19.5 J19.7 J19.9 Q4.2(S) R102.1 R113.1 R117.1 R118.1 R119.1 U19.M8(HSWAPEN_0) U19.W17(DXN_0) U19.W18(DXP_0) U20.7(GND) U21.E8(VSS) U21.H2(VSS) U21.H7(VSS) U22.3(GND) U23.2(GND) U24.1(~{O}E) U24.3(GND) X4.2(GND) ; port GND
BPI_A0: U19.AL8(IO_L13N_A00_D16_34) U21.E2(A0)
BPI_A1: U19.AK8(IO_L13P_A01_D17_34) U21.D2(A1)
BPI_A2: U19.AC9(IO_L12N_A02_D18_34) U21.C2(A2)
BPI_A3: U19.AD10(IO_L12P_A03_D19_34) U21.A2(A3)
BPI_A4: U19.C8(IO_L7N_A04_D20_34) U21.B2(A4)
BPI_A5: U19.B8(IO_L7P_A05_D21_34) U21.D3(A5)
BPI_A6: U19.E9(IO_L6N_A06_D22_34) U21.C3(A6)
BPI_A7: U19.E8(IO_L6P_A07_D23_34) U21.A3(A7)
BPI_A8: U19.A8(IO_L5N_A08_D24_34) U21.B6(A8)
BPI_A9: U19.A9(IO_L5P_A09_D25_34) U21.A6(A9)
BPI_A10: U19.D9(IO_L4N_VREF_A10_D26_34) U21.C6(A10)
BPI_A11: U19.C9(IO_L4P_A11_D27_34) U21.D6(A11)
BPI_A12: U19.D10(IO_L3N_A12_D28_34) U21.B7(A12)
BPI_A13: U19.C10(IO_L3P_A13_D29_34) U21.A7(A13)
BPI_A14: U19.F10(IO_L2N_A14_D30_34) U21.C7(A14)
BPI_A15: U19.F9(IO_L2P_A15_D31_34) U21.D7(A15)
BPI_A16: U19.AH8(IO_L18N_A16_34) U21.E7(A16)
BPI_A17: U19.AG8(IO_L18P_A17_34) U21.B3(A17)
BPI_A18: U19.AP9(IO_L17N_A18_34) U21.C4(A18)
BPI_A19: U19.AN9(IO_L17P_A19_34) U21.D5(A19)
BPI_A20: U19.AF10(IO_L16N_A20_34) U21.D4(A20)
BPI_A21: U19.AF9(IO_L16P_A21_34) U21.C5(A21)
BPI_A22: U19.AL9(IO_L15N_A22_34) U21.B8(A22)
BPI_A23: U19.AK9(IO_L15P_A23_34) U21.C8(A23)
BPI_A24: U19.AE9(IO_L14N_VREF_A24_34) U21.F8(A24)
BPI_CE#: R104.2 U19.Y24(IO_L14P_FCS_B_24) U21.F2(CE#)
BPI_DQ0: U19.AF24(IO_L13N_D0_FS0_24) U21.E3(DQ0)
BPI_DQ1: U19.AF25(IO_L13P_D1_FS1_24) U21.H3(DQ1)
BPI_DQ2: U19.W24(IO_L12N_D2_FS2_24) U21.E4(DQ2)
BPI_DQ3: U19.V24(IO_L12P_D3_24) U21.H4(DQ3)
BPI_DQ4: U19.H24(IO_L7N_D4_24) U21.H5(DQ4)
BPI_DQ5: U19.H25(IO_L7P_D5_24) U21.E5(DQ5)
BPI_DQ6: U19.P24(IO_L6N_D6_24) U21.H6(DQ6)
BPI_DQ7: U19.R24(IO_L6P_D7_24) U21.E6(DQ7)
BPI_DQ8: U19.G23(IO_L5N_D8_24) U21.F3(DQ8)
BPI_DQ9: U19.H23(IO_L5P_D9_24) U21.G3(DQ9)
BPI_DQ10: U19.N24(IO_L4N_VREF_D10_24) U21.F4(DQ10)
BPI_DQ11: U19.N23(IO_L4P_D11_24) U21.G4(DQ11)
BPI_DQ12: U19.F23(IO_L3N_D12_24) U21.F5(DQ12)
BPI_DQ13: U19.F24(IO_L3P_D13_24) U21.G6(DQ13)
BPI_DQ14: U19.L24(IO_L2N_D14_24) U21.F6(DQ14)
BPI_DQ15: U19.M23(IO_L2P_D15_24) U21.G7(DQ15)
BPI_OE#: R105.2 U19.AA24(IO_L14N_VREF_FOE_B_MOSI_24) U21.G2(OE#)
BPI_WE#: R103.2 U19.AF23(IO_L15P_FWE_B_24) U21.A5(WE#)
DONE: Q4.1(G) R110.2 U19.R8(DONE_0) U24.2(B)
INIT_B: Q5.1(GATE) R112.2 U19.P8(INIT_B_0)
JTAG.TCK: U20.5(2A) ; port JTAG.TCK
JTAG.TDI: U20.2(1A) ; port JTAG.TDI
JTAG.TDO: U22.4(Y) ; port JTAG.TDO
JTAG.TMS: U20.9(3A) ; port JTAG.TMS
TCK: J19.4 U19.AE8(TCK_0) U20.6(2Y)
TDI: J19.8 U19.AD8(TDI_0) U20.3(1Y)
TDO: J19.6 U19.AC8(TDO_0) U20.12(4A)
TMS: J19.2 U19.AF8(TMS_0) U20.8(3Y)
USB_PWREN: R100.1 U20.1(1OE#) U20.4(2OE#) U20.10(3OE#) U20.13(4OE#) U22.1(~{O}E) ; port JTAG_TCSN
NetD6_1: D6.1 Q4.3(D)
NetD6_2: D6.2 R109.1
NetD7_1: D7.1 R119.2
NetD7_2: D7.2 Q5.3(DRAIN)
NetR101_1: R101.1 X4.3(OUT)
NetR101_2: R101.2 R102.2 U19.A10(IO_L1P_GC_34)
NetR106_2: R106.2 U21.B4(WP#)
NetR107_2: R107.2 U21.B5(RESET#)
NetR108_2: R108.2 U21.A4(RY/BY#)
NetR111_1: R111.1 U19.L8(PROGRAM_B_0)
NetR113_2: R113.2 U19.U8(M0_0)
NetR114_1: R114.1 U23.4(~{MR})
NetR114_2: R114.2 U24.4(Y)
NetR115_2: R115.2 U19.W8(M1_0)
NetR116_1: R116.1 U23.1(~{RST})
NetR116_2: R116.2 R118.2 U19.AD24(IO_L11P_SRCC_24)
NetR117_2: R117.2 U19.V8(M2_0)
NetTP6_1: TP6.1 U19.K8(CCLK_0)
NetU20_11: U20.11(4Y) U22.2(B)

Not connected (* = marked no-connect by the designer): J19 10; U19 AA8(DOUT_BUSY_0)* AA23(IO_L16P_RS0_24) AB10(IO_L10N_MRCC_34) AB23(IO_L16N_CSO_B_24) AC10(IO_L10P_MRCC_34) AC22(IO_L19P_24) AC23(IO_L18P_24) AC24(IO_L18N_24) AD9(IO_L14P_A25_34) AD22(IO_L19N_24) AE22(IO_L17N_VRP_24) AE23(IO_L17P_VRN_24) AE24(IO_L11N_SRCC_24) AG23(IO_L15N_RS1_24) AH9(IO_L11P_SRCC_34) AJ9(IO_L11N_SRCC_34) AN10(IO_L19P_VRN_34) AP10(IO_L19N_VRP_34) B10(IO_L1N_GC_34) F8(CSI_B_0)* G8(RDWR_B_0)* H8(DIN_0)* H9(IO_L0N_GC_34) J9(IO_L0P_GC_34) J24(IO_L9N_MRCC_24) J25(IO_L9P_MRCC_24) K9(IO_L8N_SRCC_34) K23(IO_L1N_GC_24) K24(IO_L1P_GC_24) L9(IO_L8P_SRCC_34) L10(IO_L9P_MRCC_34) L23(IO_L0P_GC_24) M10(IO_L9N_MRCC_34) M22(IO_L0N_GC_24) T23(IO_L8N_SRCC_24) T24(IO_L8P_SRCC_24) U23(IO_L10P_MRCC_24) V23(IO_L10N_MRCC_24); U21 A1(NC) A8(NC) C1(NC) D1(NC) E1(DNU) F7(RFU) G1(RFU) H1(NC) H8(NC); U23 3(RST)

### Layout directives
net class Match_length_BPI_flash; rule Matched Net Lengths [Tolerance = 10mm]: BPI_A0, BPI_A1, BPI_A2, BPI_A3, BPI_A4, BPI_A5, BPI_A6, BPI_A7, BPI_A8, BPI_A9, BPI_A10, BPI_A11, BPI_A12, BPI_A13, BPI_A14, BPI_A15, BPI_A16, BPI_A17, BPI_A18, BPI_A19, BPI_A20, BPI_A21, BPI_A22, BPI_A23, BPI_A24, BPI_DQ0, BPI_DQ1, BPI_DQ2, BPI_DQ3, BPI_DQ4, BPI_DQ5, BPI_DQ6, BPI_DQ7, BPI_DQ8, BPI_DQ9, BPI_DQ10, BPI_DQ11, BPI_DQ12, BPI_DQ13, BPI_DQ14, BPI_DQ15

### Notes on the sheet
- (near J19) JTAG programming connector.
  Must use TC2050-XILINX adapter.
- (near R117) Mode = Master BPI-Up
- Title:
- SVN:
- August Barks gata 6B
- SE-421 32 Västra Frölunda
- Omnisys Instruments AB
- PCB ASY:
- PCB:
- SVN Folder:
- www.omnisys.se
- Page:
- of
- Print date:
- Page size:
- A3
- Information contained in this drawing is confidential. Copying, distributing or use in any matter, other than that specified by OMNISYS INSTRUMENTS AB, is strictly prohibited.
- (in symbol CMP-2100-000126-2) vcc; OE; gnd
- (in symbol CMP-2100-000586-1, part H) BANK 24
- (in symbol CMP-2100-000586-1, part M) BANK 34

### Library data of the parts
C161-C168 = CMP-0300-002665-6: Ceramic Chip Capacitor, 0603/1608; Capacitance: 100nF; Package: 1608/0603; Temperature Charateristics: X7R; Tolerance: 10%; Rated Voltage: 50V; Thickness: 900µm; Weight: 9mg
D6 = CMP-1500-000004-3
D7 = CMP-1500-000001-3
J19 = CMP-1000-000509-3: CBL PLUG-OF-NAILS 10-PIN
Q4 = CMP-1700-000042-1: MOSFET N-CH 100V 170MA SOT-23; Drain to Source Resistance: 6R; Element Configuration: Single; Fall Time: 9ns; Gate to Source Voltage (Vgs): 20V; Input Capacitance: 73pF; Max Power Dissipation: 360mW; Nominal Vgs: 1.7V; Number of Elements: 1; Turn-Off Delay Time: 17ns; Turn-On Delay Time: 1.7ns; Packaging: Tape and Reel; Case/Package: SOT-23; Contact Plating: Tin,Matte; Continuous Drain Current (ID): 170mA; Current Rating: 170mA; Drain to Source Breakdown Voltage: 100V; Drain to Source Voltage (Vdss): 100V; Dual Supply Voltage: 100V; Height: 0.93mm; Lead Free: Lead Free; Length: 2.92mm; Max Operating Temperature: 150°C; Min Operating Temperature: -55°C; Mount: Surface Mount; Number of Pins: 3; On-State Resistance: 6R; Package Quantity: 1; Power Dissipation: 360mW; Radiation Hardening: No; Rds On Max: 6R; REACH SVHC: No SVHC; Rise Time: 9ns; Threshold Voltage: 1.7V; Voltage: 100V; Voltage Rating (DC): 100V; Width: 1.3mm
Q5 = CMP-1700-000037-1: ON SEMICONDUCTOR - FDN338P - P CHANNEL MOSFET, -20V, 1.6A SUPER SOT-3; Drain to Source Voltage (Vdss): 20V; Current Rating: -1.6A; Drain to Source Resistance: 115mR; Element Configuration: Single; Fall Time: 11ns; Gate to Source Voltage (Vgs): 8V; Input Capacitance: 451pF; Max Power Dissipation: 460mW; Nominal Vgs: -800mV; Number of Elements: 1; Power Dissipation: 500mW; RDS(on): 0.115; Turn-Off Delay Time: 16ns; Turn-On Delay Time: 10ns; Packaging: Tape and Reel; Case/Package: TO-236-3; Contact Plating: Tin,Matte; Continuous Drain Current (ID): 1.6A; Drain to Source Breakdown Voltage: -20V; Lead Free: Lead Free; Max Operating Temperature: 150°C; Min Operating Temperature: -55°C; Mount: Surface Mount; Number of Pins: 3; On-State Resistance: 115mR; Package Quantity: 3000; PartNumber: FDN338P; Radiation Hardening: No; Rds On Max: 115mR; REACH SVHC: No SVHC; Rise Time: 11ns; Threshold Voltage: -800mV; Voltage Rating (DC): -20V; Weight: 0.03g
R100 R103-R108 R111 R112 = CMP-1800-002037-5: Thick film Chip Resistor, 0603/1608; Value: 4.7k; Power: 100mW; Maximum working voltage: 75V; Temp. Coefficent: 0.01%; Tolerance: 1%; Case/Package: 0603/1608; Composition: Thick film
R101 = CMP-1800-002002-5: Thick film Chip Resistor, 0603/1608; Value: 150; Power: 100mW; Maximum working voltage: 75V; Temp. Coefficent: 0.01%; Tolerance: 1%; Case/Package: 0603/1608; Composition: Thick film
R102 = CMP-1800-002014-5: Thick film Chip Resistor, 0603/1608; Value: 470; Power: 100mW; Maximum working voltage: 75V; Temp. Coefficent: 0.01%; Tolerance: 1%; Case/Package: 0603/1608; Composition: Thick film
R109 R119 = CMP-1800-002005-5: Thick film Chip Resistor, 0603/1608; Value: 200; Power: 100mW; Maximum working voltage: 75V; Temp. Coefficent: 0.01%; Tolerance: 1%; Case/Package: 0603/1608; Composition: Thick film
R110 = CMP-1800-002010-5: Thick film Chip Resistor, 0603/1608; Value: 330; Power: 100mW; Maximum working voltage: 75V; Temp. Coefficent: 0.01%; Tolerance: 1%; Case/Package: 0603/1608; Composition: Thick film
R113-R115 R117 = CMP-1800-001949-5: Thick film Chip Resistor, 0603/1608; Value: 0; Tolerance: 0%; Power: 0W; Maximum working voltage: 75V; Temp. Coefficent: 0%; Case/Package: 0603/1608; Composition: Thick film
R116 = CMP-1800-002049-5: Thick film Chip Resistor, 0603/1608; Power: 100mW; Maximum working voltage: 75V; Temp. Coefficent: 0.01%; Value: 15k; Tolerance: 1%; Case/Package: 0603/1608; Composition: Thick film
R118 = CMP-1800-002061-5: Thick film Chip Resistor, 0603/1608; Power: 100mW; Maximum working voltage: 75V; Temp. Coefficent: 0.01%; Value: 47k; Tolerance: 1%; Case/Package: 0603/1608; Composition: Thick film
TP6 = CMP-3600-000004-2: SMD Test point clip; PartNumber: S1751-46
U19 = CMP-2100-000586-1: as U19 on sheet [10] FPGA_ADC_S; Case/Package: FCBGA; Max Operating Temperature: 100°C; Min Operating Temperature: -40°C; Mount: Surface Mount; Number of Pins: 1156; Operating Supply Voltage: 1V; Package Quantity: 1
U20 = CMP-2100-000562-3: Buffer/Line Driver 4-CH Non-Inverting 3-ST CMOS 14-Pin SOIC Tube; Number of Bits: 4; Min Supply Voltage: 2V; Propagation Delay: 15ns; High Level Output Current: -8mA; Quiescent Current: 4uA; Number of Bits per Element: 1; Max Supply Voltage: 5.5V; Logic Function: Buffer,Inverting; Turn-On Delay Time: 11.5ns; Low Level Output Current: 8mA; REACH SVHC: No SVHC; Max Operating Temperature: 125°C; Polarity: Non-Inverting; Case/Package: SOIC; Number of Elements: 4; Package Quantity: 50; Number of Output Lines: 4; Min Operating Temperature: -40°C; Length: 8.65mm; Mount: Surface Mount; Number of Channels: 4; Number of Pins: 14; Termination: SMD/SMT; Number of Inputs: 4; Radiation Hardening: No; Lead Free: Lead Free; Height: 1.58mm; Number of Input Lines: 4; Packaging: Rail/Tube; Width: 3.91mm; Number of Outputs: 4
U21 = CMP-2100-000561-2: IC FLASH MEM 512MBIT PAGE 64BGA; Interface: Parallel; Memory Type: FLASH,NOR; Case/Package: FBGA; PartNumber: S29GL512S11DHIV23; Packaging: Tape and Reel; Min Operating Temperature: -40°C; Max Operating Temperature: 85°C; Number of Pins: 64
U22 U24 = CMP-2100-000126-2: Single bus buffer gate with 3-state output
U23 = CMP-2100-000175-2: Microprocessor Supervisory Circuits With Watchdog Timer and Manual Reset SOT-23-5, reset th: 3.08V
X4 = CMP-2400-000012-1: OSC TCXO 20.000MHZ LVCMOS SMD; Frequency Stability: 1ppm; Max Supply Current: 6mA; Frequency: 20MHz; Package Quantity: 250; Packaging: Tape and Reel; Case/Package: SMD/SMT; Max Operating Temperature: 85°C; Min Operating Temperature: -40°C

## Sheet [7] ETH.SchDoc: Ethernet
size 393 x 281 mm; SheetNumber: 7; SheetTotal: 21; PageSetup: Record=PageOptions|CenterHorizontal=True|CenterVertical=True|PrintScale=0.94|XCorrection=0.00|YCorrection=0.00|PrintKind=0|BorderSize=5000000|LeftOffset=0|BottomOffset=0|Orientation=2|PaperLength=1000|PaperWidth=1000|Scale=100|PaperSource=15|PrintQuality=600|MediaType=1|DitherType=10|PrintScaleMode=1|PaperKind=A4; Adr1: August Barks gata 6B; Adr2: SE-421 32 Västra Frölunda; Adr3: Sweden; Webpage: www.omnisys.se
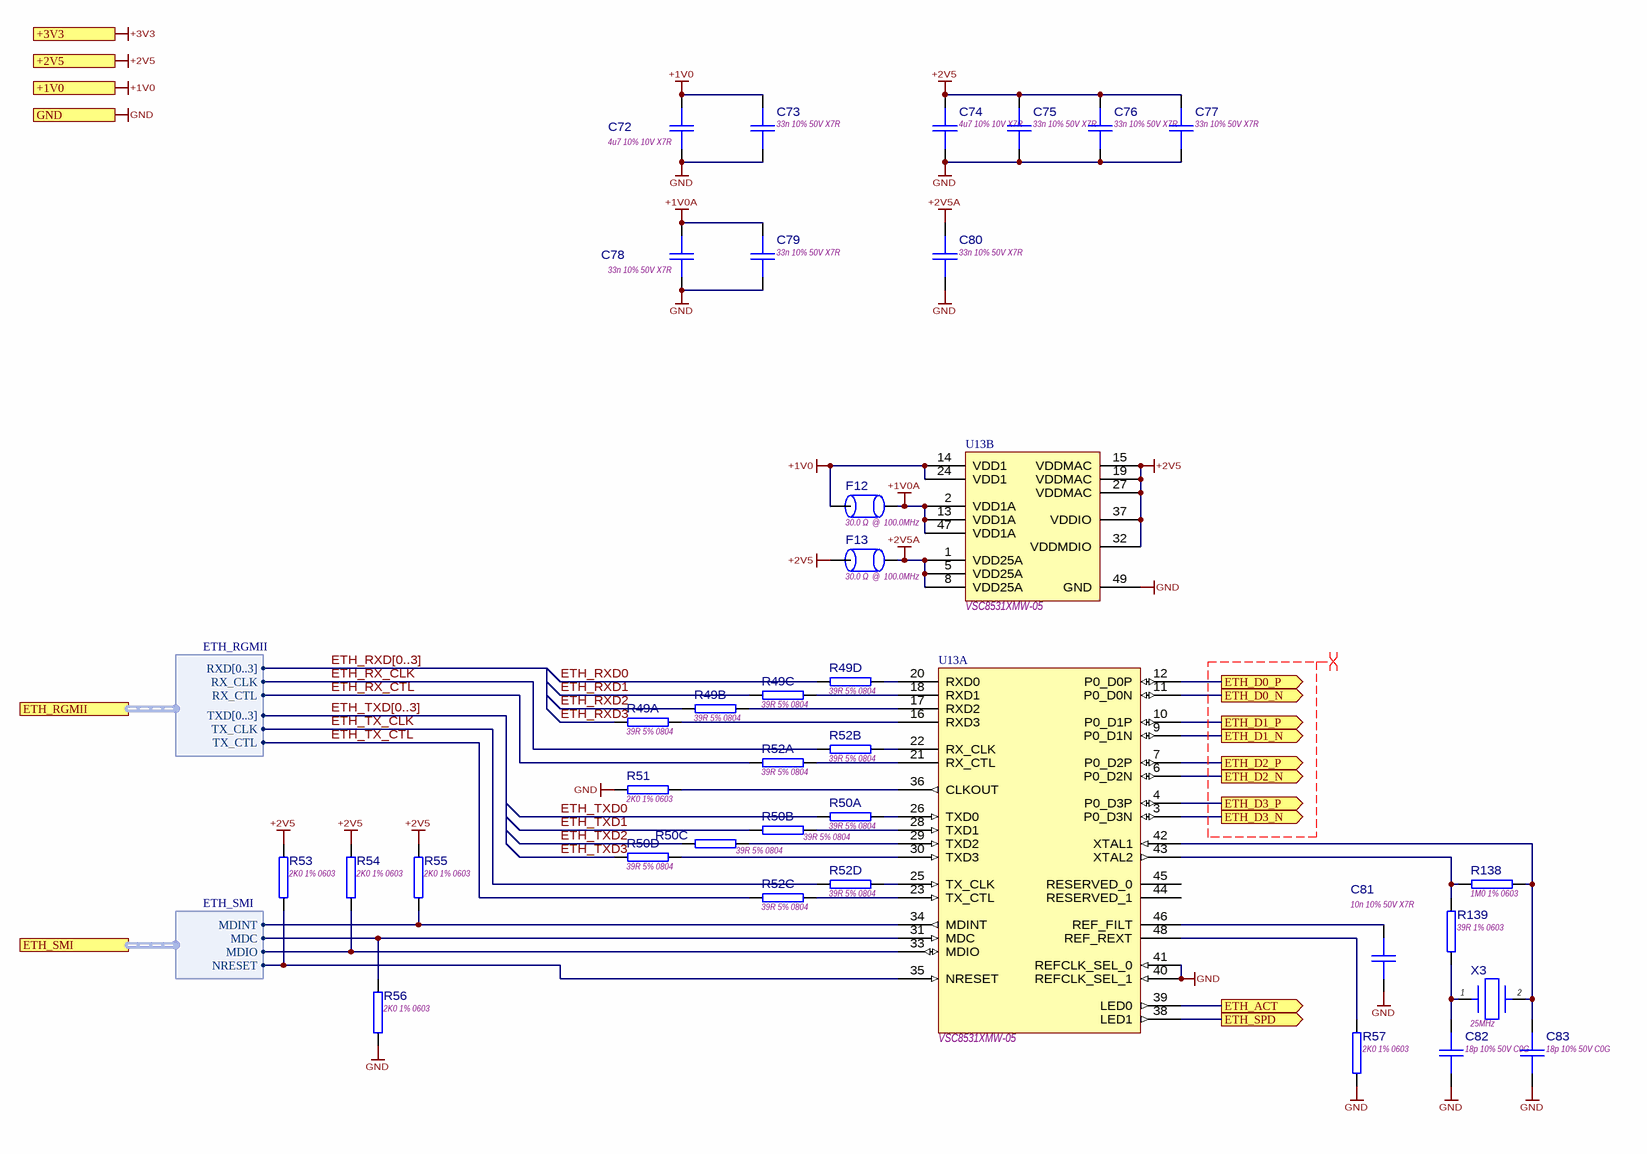
[diagram p9: [7] ETH.SchDoc]

### Parts
C72  4u7 10% 10V X7R  [CAPC2012X145N]
C73  33n 10% 50V X7R  [CAPC1005X55N]
C74  4u7 10% 10V X7R  [CAPC2012X145N]
C75  33n 10% 50V X7R  [CAPC1005X55N]
C76  33n 10% 50V X7R  [CAPC1005X55N]
C77  33n 10% 50V X7R  [CAPC1005X55N]
C78  33n 10% 50V X7R  [CAPC1005X55N]
C79  33n 10% 50V X7R  [CAPC1005X55N]
C80  33n 10% 50V X7R  [CAPC1005X55N]
C81  10n 10% 50V X7R  [CAPC1608X90N]
C82  18p 10% 50V C0G  [CAPC1608X90N]
C83  18p 10% 50V C0G  [CAPC1608X90N]
F12  30.0 Ω  @  100.0MHz  [INDC2012X11L]
F13  30.0 Ω  @  100.0MHz  [INDC2012X11L]
R49  39R 5% 0804  [RESCAXS50P100X200X45-8N]  (parts A,B,C,D of 4)
R50  39R 5% 0804  [RESCAXS50P100X200X45-8N]  (parts A,B,C,D of 4)
R51  2K0 1% 0603  [RESC1608N]
R52  39R 5% 0804  [RESCAXS50P100X200X45-8N]  (parts A,B,C,D of 4)
R53  2K0 1% 0603  [RESC1608N]
R54  2K0 1% 0603  [RESC1608N]
R55  2K0 1% 0603  [RESC1608N]
R56  2K0 1% 0603  [RESC1608N]
R57  2K0 1% 0603  [RESC1608N]
R138  1M0 1% 0603  [RESC1608L]
R139  39R 1% 0603  [RESC1608L]
U13  VSC8531XMW-05  [QFN40P600X600X90_HS-49N]  (parts A,B of 2)
X3  25MHz  [XTAL_5x3.2MM]

### Ports
+1V0, +2V5, +3V3, ETH_ACT (out), ETH_D0_N (out), ETH_D0_P (out), ETH_D1_N (out), ETH_D1_P (out), ETH_D2_N (out), ETH_D2_P (out), ETH_D3_N (out), ETH_D3_P (out), ETH_RGMII (harness ETH_RGMII), ETH_SMI (harness ETH_SMI), ETH_SPD (out), GND

### Harnesses
ETH_RGMII: RXD[0..3], RX_CLK, RX_CTL, TXD[0..3], TX_CLK, TX_CTL
ETH_SMI: MDIO, MDC, MDINT, NRESET

### Nets
+1V0: C72.2 C73.1 F12.1 U13.14(VDD1) U13.24(VDD1) ; port +1V0
+1V0A: C78.1 C79.1 F12.2 U13.2(VDD1A) U13.13(VDD1A) U13.47(VDD1A)
+2V5: C74.2 C75.1 C76.1 C77.1 F13.1 R53.2 R54.2 R55.2 U13.15(VDDMAC) U13.19(VDDMAC) U13.27(VDDMAC) U13.32(VDDMDIO) U13.37(VDDIO) ; port +2V5
+2V5A: C80.1 F13.2 U13.1(VDD25A) U13.5(VDD25A) U13.8(VDD25A)
GND: C72.1 C73.2 C74.1 C75.2 C76.2 C77.2 C78.2 C79.2 C80.2 C81.2 C82.1 C83.1 R51.2 R56.1 R57.1 U13.40(REFCLK_SEL_1) U13.41(REFCLK_SEL_0) U13.49(GND) ; port GND
ETH_ACT: U13.39(LED0) ; port ETH_ACT
ETH_D0_N: U13.11(P0_D0N) ; port ETH_D0_N
ETH_D0_P: U13.12(P0_D0P) ; port ETH_D0_P
ETH_D1_N: U13.9(P0_D1N) ; port ETH_D1_N
ETH_D1_P: U13.10(P0_D1P) ; port ETH_D1_P
ETH_D2_N: U13.6(P0_D2N) ; port ETH_D2_N
ETH_D2_P: U13.7(P0_D2P) ; port ETH_D2_P
ETH_D3_N: U13.3(P0_D3N) ; port ETH_D3_N
ETH_D3_P: U13.4(P0_D3P) ; port ETH_D3_P
ETH_RX_CLK: R52.2 ; port ETH_RGMII.RX_CLK  [project net ETH_RGMII.RX_CLK]
ETH_RX_CTL: R52.1 ; port ETH_RGMII.RX_CTL  [project net ETH_RGMII.RX_CTL]
ETH_RXD0: R49.4
ETH_RXD1: R49.3
ETH_RXD2: R49.2
ETH_RXD3: R49.1
ETH_SMI.MDC: R56.2 U13.31(MDC) ; port ETH_SMI.MDC
ETH_SMI.MDINT: R55.1 U13.34(MDINT) ; port ETH_SMI.MDINT
ETH_SMI.MDIO: R54.1 U13.33(MDIO) ; port ETH_SMI.MDIO
ETH_SMI.NRESET: R53.1 U13.35(NRESET) ; port ETH_SMI.NRESET
ETH_SPD: U13.38(LED1) ; port ETH_SPD
ETH_TX_CLK: R52.4 ; port ETH_RGMII.TX_CLK  [project net ETH_RGMII.TX_CLK]
ETH_TX_CTL: R52.3 ; port ETH_RGMII.TX_CTL  [project net ETH_RGMII.TX_CTL]
ETH_TXD0: R50.1
ETH_TXD1: R50.2
ETH_TXD2: R50.3
ETH_TXD3: R50.4
NetC81_1: C81.1 U13.46(REF_FILT)
NetC82_2: C82.2 R139.2 X3.1
NetC83_2: C83.2 R138.2 U13.42(XTAL1) X3.2
NetR49_5: R49.5 U13.20(RXD0)
NetR49_6: R49.6 U13.18(RXD1)
NetR49_7: R49.7 U13.17(RXD2)
NetR49_8: R49.8 U13.16(RXD3)
NetR50_5: R50.5 U13.30(TXD3)
NetR50_6: R50.6 U13.29(TXD2)
NetR50_7: R50.7 U13.28(TXD1)
NetR50_8: R50.8 U13.26(TXD0)
NetR51_1: R51.1 U13.36(CLKOUT)
NetR52_5: R52.5 U13.25(TX_CLK)
NetR52_6: R52.6 U13.23(TX_CTL)
NetR52_7: R52.7 U13.22(RX_CLK)
NetR52_8: R52.8 U13.21(RX_CTL)
NetR57_2: R57.2 U13.48(REF_REXT)
NetR138_1: R138.1 R139.1 U13.43(XTAL2)

Not connected (* = marked no-connect by the designer): U13 44(RESERVED_1) 45(RESERVED_0)

### Buses and harness runs
bus ETH_RXD[0..3]
bus ETH_TXD[0..3]

### Layout directives
differential pair; net class Diffpairs_ETH; rule Differential Pairs Routing [Pref Gap = 0.1mm    Min Gap  = 0.1mm    Max Gap  = 0.1mmPref Width = 0.1mm    Min Width  = 0.1mm    Max Width  = 0.1mm]: (no net found under the mark)

### Notes on the sheet
- Title:
- SVN:
- August Barks gata 6B
- SE-421 32 Västra Frölunda
- Omnisys Instruments AB
- PCB ASY:
- PCB:
- SVN Folder:
- www.omnisys.se
- Page:
- of
- Print date:
- Page size:
- A3
- Information contained in this drawing is confidential. Copying, distributing or use in any matter, other than that specified by OMNISYS INSTRUMENTS AB, is strictly prohibited.

### Library data of the parts
C72 C74 = CMP-0300-003983-5: Ceramic Chip Capacitor, 0805/2012; Capacitance: 4.7µF; Package: 2012/0805; Temperature Charateristics: X7R; Tolerance: 10%; Thickness: 1.4mm; Rated Voltage: 10V
C73 C75-C80 = CMP-0300-002958-5: Ceramic Chip Capacitor, 0402/1005; Capacitance: 33nF; Package: 0402/1005; Temperature Charateristics: X7R; Tolerance: 10%; Thickness: 550µm; Rated Voltage: 50V
C81 = CMP-0300-002475-6: Ceramic Chip Capacitor, 0603/1608; Temperature Charateristics: C0G; Tolerance: 5%; Capacitance: 10nF; Package: 1608/0603; Rated Voltage: 50V; Thickness: 900µm; Weight: 9mg
C82 C83 = CMP-0300-002440-6: Ceramic Chip Capacitor, 0603/1608; Tolerance: 5%; Capacitance: 18pF; Package: 1608/0603; Temperature Charateristics: C0G; Rated Voltage: 50V; Thickness: 900µm; Weight: 9mg
F12 F13 = CMP-0600-000010-2: Ferrite bead, Würth Elektronik WE-CBF 2012 (0805), 74279206 ,  30.0 Ω  @  100.0MHz; Zmax@Freq: 55.0 Ω  @      1.0 GHz; Type: High Current; RDC: 25.0 mΩ; IDC: 3.0 A; Z@Freq: 30.0 Ω  @  100.0MHz; PartNumber: 74279206
R49 R50 R52 = CMP-1800-003024-3: Thick film resistor array, 4 Resistors, Convex terminals, 0804/2010; Value: 39; Maximum working voltage: 50V; Temp. Coefficent: 0.02%; Power: 62.5mW; Tolerance: 5%; Case/Package: 0804/2010; Composition: Thick film
R51 R53-R57 = CMP-1800-002028-5: Thick film Chip Resistor, 0603/1608; Value: 2k; Power: 100mW; Maximum working voltage: 75V; Temp. Coefficent: 0.01%; Tolerance: 1%; Case/Package: 0603/1608; Composition: Thick film
R138 = CMP-1800-002093-5: Thick film Chip Resistor, 0603/1608; Value: 1M; Power: 100mW; Maximum working voltage: 75V; Temp. Coefficent: 0.01%; Tolerance: 1%; Case/Package: 0603/1608; Composition: Thick film
R139 = CMP-1800-001988-5: Thick film Chip Resistor, 0603/1608; Value: 39; Power: 100mW; Maximum working voltage: 75V; Temp. Coefficent: 0.01%; Tolerance: 1%; Case/Package: 0603/1608; Composition: Thick film
U13 = CMP-2100-000583-2: Single Port Gigabit Ethernet Copper PHY; Number of Circuits: 1; PartNumber: VSC8531XMW-05; Mount: Surface Mount; Case/Package: QFN; Min Operating Temperature: -40°C; Max Operating Temperature: 125°C
X3 = CMP-2400-000020-1: 25MHz 5 x 3.2 mm SMD GLASS CRYSTAL; PartNumber: 7A-25.000MAHE-T

## Sheet [16] POWER.SchDoc: Power
size 299 x 210 mm; SheetNumber: 16; SheetTotal: 21; PageSetup: Record=PageOptions|CenterHorizontal=True|CenterVertical=True|PrintScale=0.94|XCorrection=0.00|YCorrection=0.00|PrintKind=0|BorderSize=5000000|LeftOffset=0|BottomOffset=0|Orientation=2|PaperLength=1000|PaperWidth=1000|Scale=100|PaperSource=15|PrintQuality=600|MediaType=1|DitherType=10|PrintScaleMode=1|PaperKind=A4; Adr1: August Barks gata 6B; Adr2: SE-421 32 Västra Frölunda; Adr3: Sweden; Webpage: www.omnisys.se
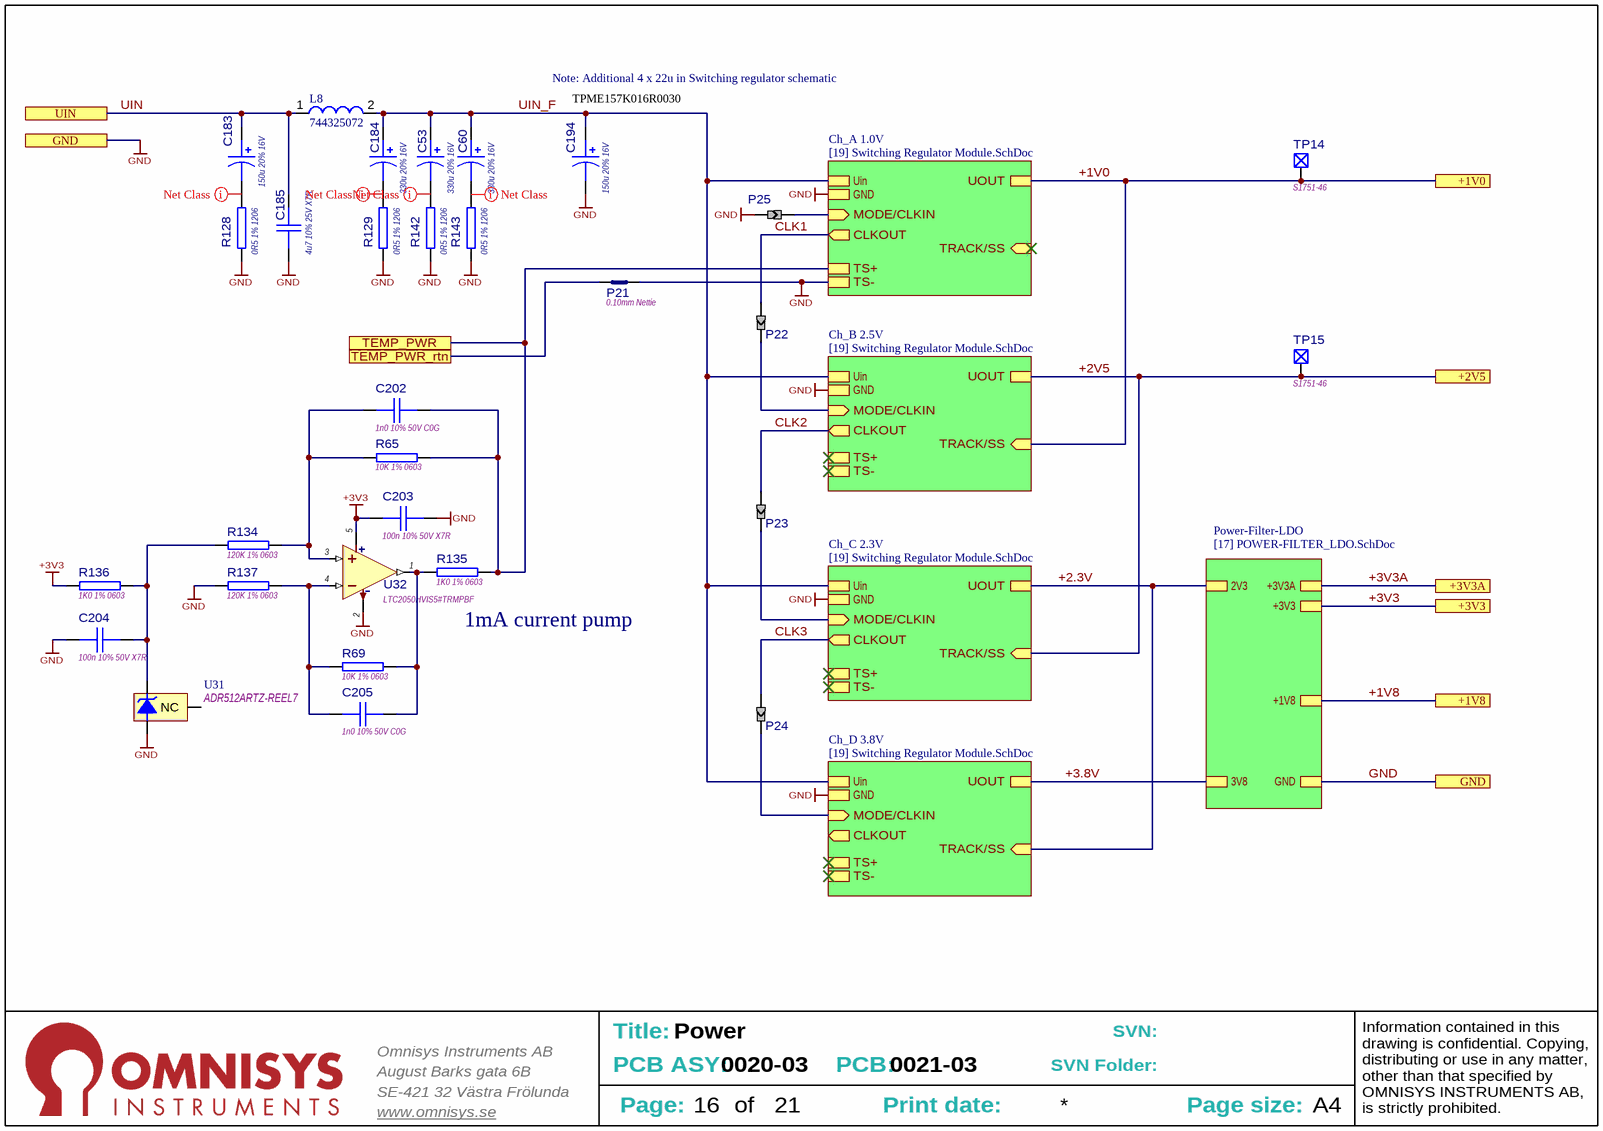
[diagram p10: [16] POWER.SchDoc]

### Parts
(Parts that share a designator on the sheet are numbered #1, #2 ... from top to bottom, then left to right.)
C53  330u 20% 16V  [CAPMP7343X43N]
C60  330u 20% 16V  [CAPMP7343X43N]
C183  150u 20% 16V  [CAPMP7343X43N]
C184  330u 20% 16V  [CAPMP7343X43N]
C185  4u7 10% 25V X7R  [CAPC3225X270N]
C194  150u 20% 16V  [CAPMP7343X43N]
C202  1n0 10% 50V C0G  [CAPC1608X90N]
C203  100n 10% 50V X7R  [CAPC1608X90N]
C204  100n 10% 50V X7R  [CAPC1608X90N]
C205  1n0 10% 50V C0G  [CAPC1608X90N]
L8  744325072  [WE-HCI-1050]
P21  0.10mm Nettie  [NETTIE_0.1MM]  (net tie, no BOM)
P22  Solder Jumper  [SolderJumper-Footprint-1]  (value not drawn)  (no BOM)
P23  Solder Jumper  [SolderJumper-Footprint-1]  (value not drawn)  (no BOM)
P24  Solder Jumper  [SolderJumper-Footprint-1]  (value not drawn)  (no BOM)
P25  Solder Jumper  [SolderJumper-Footprint-1]  (value not drawn)  (no BOM)
R65#1  10K 1% 0603  [RESC1608N]
R69#1  10K 1% 0603  [RESC1608N]
R128  0R5 1% 1206  [RESC3216N]
R129  0R5 1% 1206  [RESC3216N]
R134  120K 1% 0603  [RESC1608N]
R135  1K0 1% 0603  [RESC1608N]
R136  1K0 1% 0603  [RESC1608N]
R137  120K 1% 0603  [RESC1608N]
R142  0R5 1% 1206  [RESC3216N]
R143  0R5 1% 1206  [RESC3216N]
TP14  S1751-46  [S1751-46]
TP15  S1751-46  [S1751-46]
U31  ADR512ARTZ-REEL7  [SOT95P230X110-3N]
U32  LTC2050HVIS5#TRMPBF  [SOT95P280X100-5N]

### Sub-sheets
Ch_A 1.0V = [19] Switching Regulator Module.SchDoc: Uin, GND, CLKOUT (out), MODE/CLKIN (in), UOUT, TRACK/SS (in), TS-, TS+
Ch_B 2.5V = [19] Switching Regulator Module.SchDoc: Uin, GND, CLKOUT (out), MODE/CLKIN (in), UOUT, TRACK/SS (in), TS-, TS+
Ch_C 2.3V = [19] Switching Regulator Module.SchDoc: Uin, GND, CLKOUT (out), MODE/CLKIN (in), UOUT, TRACK/SS (in), TS-, TS+
Ch_D 3.8V = [19] Switching Regulator Module.SchDoc: Uin, GND, CLKOUT (out), MODE/CLKIN (in), UOUT, TRACK/SS (in), TS-, TS+
Power-Filter-LDO = [17] POWER-FILTER_LDO.SchDoc: +3V3, 3V8, +1V8, 2V3, GND, +3V3A

### Ports
+1V0, +1V8, +2V5, +3V3, +3V3A, GND, TEMP_PWR, TEMP_PWR_rtn, UIN

### Nets
+1V0: TP14.1 ; port +1V0, sheet Ch_A 1.0V/UOUT, sheet Ch_B 2.5V/TRACK/SS
+1V8: port +1V8, sheet Power-Filter-LDO/+1V8
+2.3V: sheet Power-Filter-LDO/2V3, sheet Ch_C 2.3V/UOUT, sheet Ch_D 3.8V/TRACK/SS  [project net +2V3]
+2V5: TP15.1 ; port +2V5, sheet Ch_B 2.5V/UOUT, sheet Ch_C 2.3V/TRACK/SS
+3V3: C203.2 R136.2 U32.5(+V) ; port +3V3, sheet Power-Filter-LDO/+3V3
+3V3A: port +3V3A, sheet Power-Filter-LDO/+3V3A
GND: C185.2 C194.2 C203.1 C204.1 P21.2 P25.1 R128.2 R129.2 R137.1 R142.2 R143.2 U31.2(-V) U32.2(-V) ; port GND, sheet Ch_A 1.0V/GND, sheet Ch_A 1.0V/TS-, sheet Power-Filter-LDO/GND, sheet Ch_B 2.5V/GND, sheet Ch_C 2.3V/GND, sheet Ch_D 3.8V/GND
+3.8V: sheet Power-Filter-LDO/3V8, sheet Ch_D 3.8V/UOUT
CLK1: P22.1 ; sheet Ch_A 1.0V/CLKOUT
CLK2: P23.1 ; sheet Ch_B 2.5V/CLKOUT
CLK3: P24.1 ; sheet Ch_C 2.3V/CLKOUT
TEMP_PWR: C202.1 R65#1.2 R135.1 ; port TEMP_PWR, sheet Ch_A 1.0V/TS+
TEMP_PWR_rtn: P21.1 ; port TEMP_PWR_rtn
UIN: C183.1 C185.1 L8.1 ; port UIN
UIN_F: C53.1 C60.1 C184.1 C194.1 L8.2 ; sheet Ch_A 1.0V/Uin, sheet Ch_B 2.5V/Uin, sheet Ch_C 2.3V/Uin, sheet Ch_D 3.8V/Uin
NetC53_2: C53.2 R142.1
NetC60_2: C60.2 R143.1
NetC183_2: C183.2 R128.1
NetC184_2: C184.2 R129.1
NetC202_2: C202.2 R65#1.1 R134.2 U32.3(+IN)
NetC204_2: C204.2 R134.1 R136.1 U31.1(+V)
NetC205_1: C205.1 R69#1.2 R135.2 U32.1(OUT)
NetC205_2: C205.2 R69#1.1 R137.2 U32.4(-IN)
NetP22_2: P22.2 ; sheet Ch_B 2.5V/MODE/CLKIN
NetP23_2: P23.2 ; sheet Ch_C 2.3V/MODE/CLKIN
NetP24_2: P24.2 ; sheet Ch_D 3.8V/MODE/CLKIN
NetP25_2: P25.2 ; sheet Ch_A 1.0V/MODE/CLKIN

Not connected (* = marked no-connect by the designer): U31 3(NC)

### Layout directives
net class Power: NetC53_2, NetC60_2, NetC183_2, NetC184_2

### Notes on the sheet
- Note: Additional 4 x 22u in Switching regulator schematic
- (near C194) TPME157K016R0030
- (near R135) 1mA current pump
- August Barks gata 6B
- Omnisys Instruments AB
- Title:
- PCB ASY:
- PCB:
- SVN:
- SVN Folder:
- SE-421 32 Västra Frölunda
- www.omnisys.se
- Page:
- of
- Print date:
- Page size:
- A4
- Information contained in this drawing is confidential. Copying, distributing or use in any matter, other than that specified by OMNISYS INSTRUMENTS AB, is strictly prohibited.

### Library data of the parts
C53 C60 C184 = CMP-0300-000208-8: Standard tantalum capacitor, 7343/Case E; DCL: 52.8A; Capacitance: 330µF; DF: 30%; ESR: 0.4; Rated Voltage: 16V; Tolerance: 20%; Case/Package: 7343
C183 C194 = CMP-0300-000235-8: Standard tantalum capacitor, 7343/Case E; ESR: 0.3; DCL: 23A; Capacitance: 150µF; DF: 8%; Rated Voltage: 16V; Tolerance: 20%; Case/Package: 7343
C185 = CMP-0300-003012-4: Ceramic Chip Capacitor, 1210/3225; Capacitance: 4.7µF; Temperature Charateristics: X7R; Tolerance: 10%; Thickness: 2.7mm; Case/Package: 1210/3225; Rated Voltage: 25V
C202 C205 = CMP-0300-002463-5: Ceramic Chip Capacitor, 0603/1608; Tolerance: 5%; Capacitance: 1nF; Package: 1608/0603; Temperature Charateristics: C0G; Rated Voltage: 50V; Thickness: 900µm; Weight: 9mg
C203 C204 = CMP-0300-002665-6: as C161-C168 on sheet [11] FPGA_CONFIG; Package: 1608/0603; Temperature Charateristics: X7R; Tolerance: 10%; Rated Voltage: 50V; Thickness: 900µm; Weight: 9mg
L8 = CMP-1200-000454-1: Inductor, SMD, 1005 0.72 uH 22 A ±20%, 744325072, Würth Elektronik; Inductance: 720nH; Test Frequency: 100kHz; DC Resistance (DCR): 1.3mR; Saturation Current: 35A; Shielding: Shielded; Self Resonant Frequency: 115MHz; RMS Current (Irms): 22A; Series Resistance: 1.3R; Length: 0.402inch; Mount: Surface Mount; Tolerance: 20%; Case/Package: Nonstandard; Inductance Tolerance: 20%; Termination: SMD/SMT; Composition: Wirewound; Height - Seated (Max): 0.197inch; Width: 10.2mm; Min Operating Temperature: -40°C; Height: 4.7mm; Package Quantity: 700; Max Operating Temperature: 150°C; Max DC Current: 22A; Current Rating: 22A; Packaging: Tape and Reel; REACH SVHC: Unknown
P21 = CMP-1600-000016-1: Copper object for merging nets on PCB
P22-P25 = CMP-1600-000025-5: Solder jumper, clearance 0.125mm
R65#1 R69#1 = CMP-1800-002045-5: Thick film Chip Resistor, 0603/1608; Power: 100mW; Maximum working voltage: 75V; Temp. Coefficent: 0.01%; Value: 10k; Tolerance: 1%; Case/Package: 0603/1608; Composition: Thick film
R128 R129 R142 R143 = CMP-1800-003168-2: Thick film Chip Resistor, 1206/3216; Value: 0.5; Temp. Coefficent: 0.01%; Maximum working voltage: 200V; Power: 250mW; Tolerance: 1%; Case/Package: 1206/3216; Composition: Thick film
R134 R137 = CMP-1800-002071-5: Thick film Chip Resistor, 0603/1608; Power: 100mW; Maximum working voltage: 75V; Temp. Coefficent: 0.01%; Value: 120k; Tolerance: 1%; Case/Package: 0603/1608; Composition: Thick film
R135 = CMP-1800-002021-5: Thick film Chip Resistor, 0603/1608; Value: 1k; Power: 100mW; Maximum working voltage: 75V; Temp. Coefficent: 0.01%; Tolerance: 1%; Case/Package: 0603/1608; Composition: Thick film
R136 = CMP-1800-002021-5: Thick film Chip Resistor, 0603/1608; Maximum working voltage: 75V; Temp. Coefficent: 0.01%; Value: 1k; Power: 100mW; Tolerance: 1%; Case/Package: 0603/1608; Composition: Thick film
TP14 TP15 = CMP-3600-000004-2: SMD Test point clip; PartNumber: S1751-46
U31 = CMP-2100-000594-1: 1.2 V Precision Low Noise Shunt Voltage Reference; Max Output Current: 10mA; Max Output Voltage: 1.2V; Temperature Coefficient: 60ppm/°C; Tolerance: 0.3%; Cathode Current: 100uA; Output Type: Fixed; Case/Package: SOT; Height: 1.02mm; Lead Free: Contains Lead; Length: 3.04mm; Max Operating Temperature: 85°C; Min Operating Temperature: -40°C; Number of Pins: 3; Output Current: 10mA; Output Voltage: 1.2V; Package Quantity: 1; Packaging: Tape and Reel; Radiation Hardening: No; REACH SVHC: No SVHC; Reference Type: Shunt; Reference Voltage: 1.2V; Width: 1.4mm; Min Output Voltage: 1.2V
U32 = CMP-2100-000593-1: Zero-Drift Operational Amplifiers in SOT-23; Common Mode Rejection Ratio: 120dB; Gain Bandwidth Product: 3MHz; Input Bias Current: 25pA; Input Offset Voltage (Vos): 0.5uV; Max Dual Supply Voltage: 5.5V; Max Frequency: 7.5kHz; Max Supply Voltage: 11V; Min Dual Supply Voltage: 1.35V; Min Supply Voltage: 2.7V; Number of Channels: 1; Operating Supply Current: 1mA; Slew Rate: 2V/µs; Voltage Gain: 140dB; Case/Package: SOT-23-5; Height: 0.9mm; Lead Free: Lead Free; Length: 2.9mm; Max Operating Temperature: 85°C; Min Operating Temperature: -40°C; Nominal Gain Bandwidth Product: 3MHz; Number of Circuits: 1; Number of Elements: 1; Number of Pins: 5; Package Quantity: 1; Packaging: Tape and Reel; Power Supply Rejection Ratio (PSRR): 120dB; Unity Gain Bandwidth Product: 3MHz; Width: 1.75mm